# Altium project pay-ssm.PrjPCB (part 1 of 2)
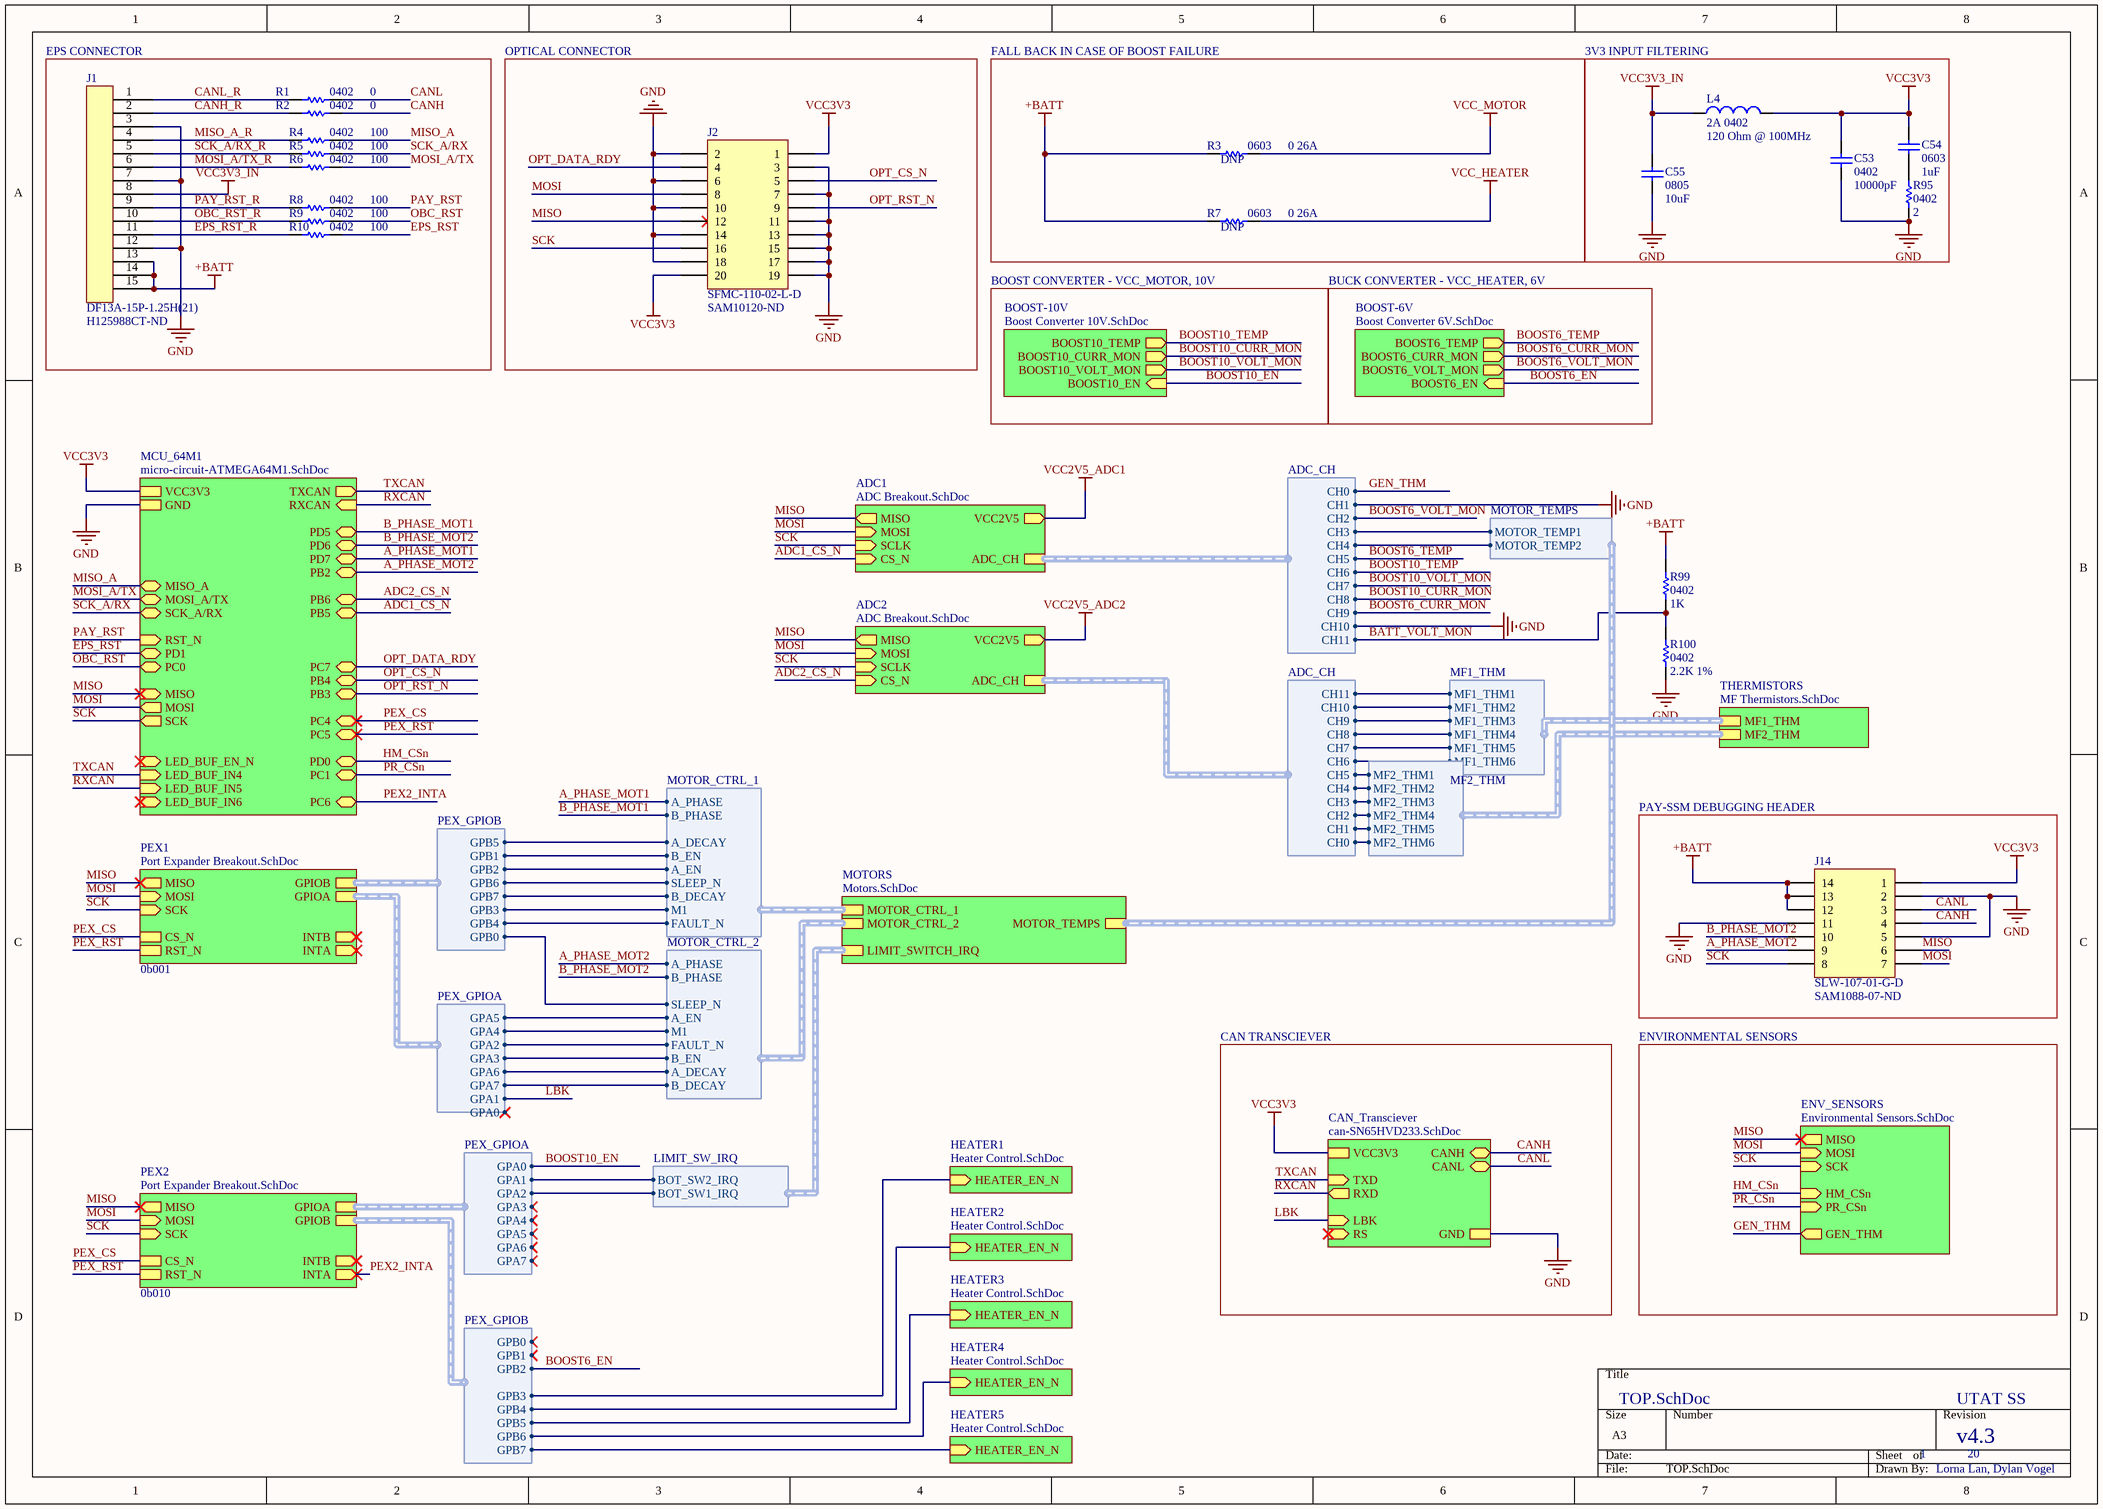
[diagram p0: TOP.SchDoc]
PROJ_ORG: UTAT SS; PROJ_REVISION: 4.2
11 sheets, 183 parts. Net scope: hierarchical (ports join the sheet entries above them; power ports are global).
Board files: pay-ssm-v3.PcbDoc, pay-ssm-v4-5.PcbDoc
Sheets:
  TOP.SchDoc
    ENV_SENSORS = Environmental Sensors.SchDoc
    BOOST-10V = Boost Converter 10V.SchDoc
    PEX1 = Port Expander Breakout.SchDoc
    PEX2 = Port Expander Breakout.SchDoc
    MOTORS = Motors.SchDoc
      MOTOR_FB = Motors State Monitor.SchDoc
      MOTOR_DRV1 = DRV8834.SchDoc
      MOTOR_DRV2 = DRV8834.SchDoc
    HEATER1 = Heater Control.SchDoc
    HEATER2 = Heater Control.SchDoc
    HEATER3 = Heater Control.SchDoc
    HEATER4 = Heater Control.SchDoc
    HEATER5 = Heater Control.SchDoc
    THERMISTORS = MF Thermistors.SchDoc
    ADC1 = ADC Breakout.SchDoc
    ADC2 = ADC Breakout.SchDoc
    BOOST-6V = Boost Converter 6V.SchDoc

## Sheet TOP.SchDoc
size A3; DrawnBy: Lorna Lan, Dylan Vogel; DocumentNumber: 1; Revision: v4.3; SheetNumber: 1; SheetTotal: 20

### Parts
C53  0402  value 10000pF  [CAP0402R]
C54  0603  value 1uF  [CAP0603R]
C55  0805  value 10uF  [CAP0805R]
J1  DF13A-15P-1.25H(21)  Supplier Part Number 1: H125988CT-ND  [DF13A-15P-1.25H(21)]
J2  SFMC-110-02-L-D  Supplier Part Number 1: SAM10120-ND  [TFM-110-02-L-D]
J14  SLW-107-01-G-D  Supplier Part Number 1: SAM1088-07-ND  [SLW-107-01-X-D]
L4  2A 0402  value 120 Ohm @ 100MHz  [RES0402R]
R1  0402  value 0  [RES0402R]
R2  0402  value 0  [RES0402R]
R3  0603  value 0 26A  [RES0603R]
R4  0402  value 100  [RES0402R]
R5  0402  value 100  [RES0402R]
R6  0402  value 100  [RES0402R]
R7  0603  value 0 26A  [RES0603R]
R8  0402  value 100  [RES0402R]
R9  0402  value 100  [RES0402R]
R10  0402  value 100  [RES0402R]
R95  0402  value 2  [RES0402R]
R99  0402  value 1K  [RES0402R]
R100  0402  value 2.2K 1%  [RES0402R]

### Blocks framed on the sheet
EPS CONNECTOR: J1 R1 R2 R4-R6 R8-R10
OPTICAL CONNECTOR: J2
3V3 INPUT FILTERING: C53-C55 L4 R95
PAY-SSM DEBUGGING HEADER: J14

### Sub-sheets
ADC1 = ADC Breakout.SchDoc: MISO (out), ADC_CH (harness ADC_CH), SCLK (in), MOSI (in), CS_N (in), VCC2V5 (out)
ADC2 = ADC Breakout.SchDoc: MISO (out), ADC_CH (harness ADC_CH), SCLK (in), MOSI (in), CS_N (in), VCC2V5 (out)
BOOST-6V = Boost Converter 6V.SchDoc: BOOST6_TEMP (out), BOOST6_CURR_MON (out), BOOST6_VOLT_MON (out), BOOST6_EN (in)
BOOST-10V = Boost Converter 10V.SchDoc: BOOST10_CURR_MON (out), BOOST10_VOLT_MON (out), BOOST10_EN (in), BOOST10_TEMP (out)
CAN_Transciever = can-SN65HVD233.SchDoc (file not in this document): RS (in), GND, CANH (bidir), CANL (bidir), LBK (in), TXD (in), RXD (out), VCC3V3
ENV_SENSORS = Environmental Sensors.SchDoc: SCK (in), MOSI (in), MISO (out), PR_CSn (in), HM_CSn (in), GEN_THM (out)
HEATER1 = Heater Control.SchDoc: HEATER_EN_N (in)
HEATER2 = Heater Control.SchDoc: HEATER_EN_N (in)
HEATER3 = Heater Control.SchDoc: HEATER_EN_N (in)
HEATER4 = Heater Control.SchDoc: HEATER_EN_N (in)
HEATER5 = Heater Control.SchDoc: HEATER_EN_N (in)
MCU_64M1 = micro-circuit-ATMEGA64M1.SchDoc (file not in this document): GND, PD6 (bidir), PD1 (bidir), PC7 (bidir), PC4 (bidir), PB5 (bidir), PB2 (bidir), PB3 (bidir), PB4 (bidir), PC0 (bidir), TXCAN (out), RXCAN (in), SCK (out), MOSI (out), LED_BUF_IN6 (in), MOSI_A/TX (bidir), LED_BUF_IN4 (in), LED_BUF_IN5 (in), SCK_A/RX (bidir), MISO (in), MISO_A (bidir), RST_N (in), LED_BUF_EN_N (in), VCC3V3, PD7 (bidir), PC6 (bidir), PD5 (bidir), PC5 (bidir), PB6 (bidir), PD0 (bidir), PC1 (bidir)
MOTORS = Motors.SchDoc: MOTOR_CTRL_1 (harness MOTOR_CTRL_1), MOTOR_CTRL_2 (harness MOTOR_CTRL_2), MOTOR_TEMPS (harness MOTOR_TEMPS), LIMIT_SWITCH_IRQ (harness LIMIT_SW_IRQ)
PEX1 = Port Expander Breakout.SchDoc: INTB (out), INTA (out), GPIOA (harness PEX_GPIOA), MISO (out), MOSI (in), GPIOB (harness PEX_GPIOB), SCK (in), RST_N, CS_N  | ADDRESS: 0b001
PEX2 = Port Expander Breakout.SchDoc: INTB (out), INTA (out), GPIOA (harness PEX_GPIOA), MISO (out), MOSI (in), GPIOB (harness PEX_GPIOB), SCK (in), RST_N, CS_N  | ADDRESS: 0b010
THERMISTORS = MF Thermistors.SchDoc: MF1_THM (harness MF1_THM), MF2_THM (harness MF2_THM)

### Harnesses
MOTOR_CTRL_1: SLEEP_N, A_EN, A_PHASE, B_PHASE, FAULT_N, M1, A_DECAY, B_DECAY, B_EN
PEX_GPIOA: GPA0, GPA1, GPA2, GPA3, GPA4, GPA5, GPA6, GPA7
PEX_GPIOB: GPB1, GPB6, GPB5, GPB4, GPB3, GPB0, GPB2, GPB7
MOTOR_CTRL_2: SLEEP_N, A_EN, B_EN, A_PHASE, B_PHASE, FAULT_N, M1, A_DECAY, B_DECAY
ADC_CH: CH0, CH1, CH2, CH3, CH4, CH5, CH6, CH7, CH8, CH9, CH10, CH11
PEX_GPIOB: GPB0, GPB1, GPB2, GPB3, GPB4, GPB5, GPB6, GPB7
MOTOR_TEMPS: MOTOR_TEMP1, MOTOR_TEMP2
MF1_THM: MF1_THM1, MF1_THM2, MF1_THM3, MF1_THM4, MF1_THM5, MF1_THM6
MF2_THM: MF2_THM1, MF2_THM2, MF2_THM3, MF2_THM4, MF2_THM5, MF2_THM6
LIMIT_SW_IRQ: BOT_SW1_IRQ, BOT_SW2_IRQ

### Nets
+BATT: J1.13 J1.14 J1.15 J14.2(14) J14.4(13) J14.6(12) R3.1 R7.1 R99.2
GND: C53.1 C55.1 J1.3 J1.7 J1.12 J2.2 J2.3 J2.6 J2.7 J2.10 J2.11 J2.13 J2.14 J2.15 J2.17 J2.18 J2.19 J14.3(2) J14.8(11) J14.9(5) R95.1 R100.1 ; sheet CAN_Transciever/GND, sheet MCU_64M1/GND, sheet ADC1/ADC_CH.CH1, sheet ADC1/ADC_CH.CH10
VCC2V5_ADC1: sheet ADC1/VCC2V5
VCC2V5_ADC2: sheet ADC2/VCC2V5
VCC3V3: C53.2 C54.2 J2.1 J2.20 J14.1 L4.2 ; sheet CAN_Transciever/VCC3V3, sheet MCU_64M1/VCC3V3
VCC3V3_IN: C55.2 J1.8 L4.1
VCC_HEATER: R7.2
VCC_MOTOR: R3.2
A_PHASE_MOT1: sheet MCU_64M1/PD7, sheet MOTORS/MOTOR_CTRL_1.A_PHASE
A_PHASE_MOT2: J14.12(9) ; sheet MCU_64M1/PB2, sheet MOTORS/MOTOR_CTRL_2.A_PHASE
ADC1_CS_N: sheet MCU_64M1/PB5, sheet ADC1/CS_N
ADC2_CS_N: sheet MCU_64M1/PB6, sheet ADC2/CS_N
ADECAY_MOTOR_DRV1: sheet MOTORS/MOTOR_CTRL_1.A_DECAY, sheet PEX1/GPIOB.GPB5
ADECAY_MOTOR_DRV2: sheet MOTORS/MOTOR_CTRL_2.A_DECAY, sheet PEX1/GPIOA.GPA6
AENBL_MOTOR_DRV1: sheet MOTORS/MOTOR_CTRL_1.A_EN, sheet PEX1/GPIOB.GPB2
AENBL_MOTOR_DRV2: sheet MOTORS/MOTOR_CTRL_2.A_EN, sheet PEX1/GPIOA.GPA5
B_PHASE_MOT1: sheet MCU_64M1/PD5, sheet MOTORS/MOTOR_CTRL_1.B_PHASE
B_PHASE_MOT2: J14.10 ; sheet MCU_64M1/PD6, sheet MOTORS/MOTOR_CTRL_2.B_PHASE
BATT_VOLT_MON: R99.1 R100.2 ; sheet ADC1/ADC_CH.CH11
BDECAY_MOTOR_DRV1: sheet MOTORS/MOTOR_CTRL_1.B_DECAY, sheet PEX1/GPIOB.GPB7
BDECAY_MOTOR_DRV2: sheet MOTORS/MOTOR_CTRL_2.B_DECAY, sheet PEX1/GPIOA.GPA7
BENBL_MOTOR_DRV1: sheet MOTORS/MOTOR_CTRL_1.B_EN, sheet PEX1/GPIOB.GPB1
BENBL_MOTOR_DRV2: sheet MOTORS/MOTOR_CTRL_2.B_EN, sheet PEX1/GPIOA.GPA3
BOOST6_CURR_MON: sheet BOOST-6V/BOOST6_CURR_MON, sheet ADC1/ADC_CH.CH9
BOOST6_EN: sheet BOOST-6V/BOOST6_EN, sheet PEX2/GPIOB.GPB2
BOOST6_TEMP: sheet BOOST-6V/BOOST6_TEMP, sheet ADC1/ADC_CH.CH5
BOOST6_VOLT_MON: sheet BOOST-6V/BOOST6_VOLT_MON, sheet ADC1/ADC_CH.CH2
BOOST10_CURR_MON: sheet BOOST-10V/BOOST10_CURR_MON, sheet ADC1/ADC_CH.CH8
BOOST10_EN: sheet BOOST-10V/BOOST10_EN, sheet PEX2/GPIOA.GPA0
BOOST10_TEMP: sheet BOOST-10V/BOOST10_TEMP, sheet ADC1/ADC_CH.CH6
BOOST10_VOLT_MON: sheet BOOST-10V/BOOST10_VOLT_MON, sheet ADC1/ADC_CH.CH7
BOT_SW1_IRQ: sheet PEX2/GPIOA.GPA2, sheet MOTORS/LIMIT_SWITCH_IRQ.BOT_SW1_IRQ
BOT_SW2_IRQ: sheet PEX2/GPIOA.GPA1, sheet MOTORS/LIMIT_SWITCH_IRQ.BOT_SW2_IRQ
CANH: J14.7(4) R2.2 ; sheet CAN_Transciever/CANH
CANH_R: J1.2 R2.1
CANL: J14.5(3) R1.2 ; sheet CAN_Transciever/CANL
CANL_R: J1.1 R1.1
EPS_RST: R10.2 ; sheet MCU_64M1/PD1
EPS_RST_R: J1.11 R10.1
GEN_THM: sheet ENV_SENSORS/GEN_THM, sheet ADC1/ADC_CH.CH0
HEATER_EN_N_HEATER1: sheet HEATER1/HEATER_EN_N, sheet PEX2/GPIOB.GPB3
HEATER_EN_N_HEATER2: sheet HEATER2/HEATER_EN_N, sheet PEX2/GPIOB.GPB4
HEATER_EN_N_HEATER3: sheet HEATER3/HEATER_EN_N, sheet PEX2/GPIOB.GPB5
HEATER_EN_N_HEATER4: sheet HEATER4/HEATER_EN_N, sheet PEX2/GPIOB.GPB6
HEATER_EN_N_HEATER5: sheet HEATER5/HEATER_EN_N, sheet PEX2/GPIOB.GPB7
HM_CSn: sheet ENV_SENSORS/HM_CSn, sheet MCU_64M1/PD0
LBK: sheet CAN_Transciever/LBK, sheet PEX1/GPIOA.GPA1
M1_MOTOR_DRV1: sheet MOTORS/MOTOR_CTRL_1.M1, sheet PEX1/GPIOB.GPB3
M1_MOTOR_DRV2: sheet MOTORS/MOTOR_CTRL_2.M1, sheet PEX1/GPIOA.GPA4
MF1_THM1: sheet ADC2/ADC_CH.CH11, sheet THERMISTORS/MF1_THM.MF1_THM1
MF1_THM2: sheet ADC2/ADC_CH.CH10, sheet THERMISTORS/MF1_THM.MF1_THM2
MF1_THM3: sheet ADC2/ADC_CH.CH9, sheet THERMISTORS/MF1_THM.MF1_THM3
MF1_THM4: sheet ADC2/ADC_CH.CH8, sheet THERMISTORS/MF1_THM.MF1_THM4
MF1_THM5: sheet ADC2/ADC_CH.CH7, sheet THERMISTORS/MF1_THM.MF1_THM5
MF1_THM6: sheet ADC2/ADC_CH.CH6, sheet THERMISTORS/MF1_THM.MF1_THM6
MF2_THM1: sheet ADC2/ADC_CH.CH5, sheet THERMISTORS/MF2_THM.MF2_THM1
MF2_THM2: sheet ADC2/ADC_CH.CH4, sheet THERMISTORS/MF2_THM.MF2_THM2
MF2_THM3: sheet ADC2/ADC_CH.CH3, sheet THERMISTORS/MF2_THM.MF2_THM3
MF2_THM4: sheet ADC2/ADC_CH.CH2, sheet THERMISTORS/MF2_THM.MF2_THM4
MF2_THM5: sheet ADC2/ADC_CH.CH1, sheet THERMISTORS/MF2_THM.MF2_THM5
MF2_THM6: sheet ADC2/ADC_CH.CH0, sheet THERMISTORS/MF2_THM.MF2_THM6
MISO: J2.12 J14.11(6) ; sheet ENV_SENSORS/MISO, sheet MCU_64M1/MISO, sheet PEX1/MISO, sheet PEX2/MISO, sheet ADC1/MISO, sheet ADC2/MISO
MISO_A: R4.2 ; sheet MCU_64M1/MISO_A
MISO_A_R: J1.4 R4.1
MOSI: J2.8 J14.13(7) ; sheet ENV_SENSORS/MOSI, sheet MCU_64M1/MOSI, sheet PEX1/MOSI, sheet PEX2/MOSI, sheet ADC1/MOSI, sheet ADC2/MOSI
MOSI_A/TX: R6.2 ; sheet MCU_64M1/MOSI_A/TX
MOSI_A/TX_R: J1.6 R6.1
nFAULT_MOTOR_DRV1: sheet MOTORS/MOTOR_CTRL_1.FAULT_N, sheet PEX1/GPIOB.GPB4
nFAULT_MOTOR_DRV2: sheet MOTORS/MOTOR_CTRL_2.FAULT_N, sheet PEX1/GPIOA.GPA2
nSLEEP_MOTOR_DRV1: sheet MOTORS/MOTOR_CTRL_1.SLEEP_N, sheet PEX1/GPIOB.GPB6
nSLEEP_MOTOR_DRV2: sheet MOTORS/MOTOR_CTRL_2.SLEEP_N, sheet PEX1/GPIOB.GPB0
OBC_RST: R9.2 ; sheet MCU_64M1/PC0
OBC_RST_R: J1.10 R9.1
OPT_CS_N: J2.5 ; sheet MCU_64M1/PB4
OPT_DATA_RDY: J2.4 ; sheet MCU_64M1/PC7
OPT_RST_N: J2.9 ; sheet MCU_64M1/PB3
PAY_RST: R8.2 ; sheet MCU_64M1/RST_N
PAY_RST_R: J1.9 R8.1
PEX2_INTA: sheet MCU_64M1/PC6, sheet PEX2/INTA
PEX_CS: sheet MCU_64M1/PC4, sheet PEX1/CS_N, sheet PEX2/CS_N
PEX_RST: sheet MCU_64M1/PC5, sheet PEX1/RST_N, sheet PEX2/RST_N
PR_CSn: sheet ENV_SENSORS/PR_CSn, sheet MCU_64M1/PC1
RXCAN: sheet CAN_Transciever/RXD, sheet MCU_64M1/RXCAN, sheet MCU_64M1/LED_BUF_IN5
SCK: J2.16 J14.14(8) ; sheet ENV_SENSORS/SCK, sheet MCU_64M1/SCK, sheet PEX1/SCK, sheet PEX2/SCK, sheet ADC1/SCLK, sheet ADC2/SCLK
SCK_A/RX: R5.2 ; sheet MCU_64M1/SCK_A/RX
SCK_A/RX_R: J1.5 R5.1
TXCAN: sheet CAN_Transciever/TXD, sheet MCU_64M1/TXCAN, sheet MCU_64M1/LED_BUF_IN4
NetC54_1: C54.1 R95.2
(unnamed): sheet ADC1/ADC_CH.CH3, sheet MOTORS/MOTOR_TEMPS.MOTOR_TEMP1
(unnamed): sheet ADC1/ADC_CH.CH4, sheet MOTORS/MOTOR_TEMPS.MOTOR_TEMP2

### Notes on the sheet
- FALL BACK IN CASE OF BOOST FAILURE
- (near R3) DNP
- (near R7) DNP
- BOOST CONVERTER - VCC_MOTOR, 10V
- BUCK CONVERTER - VCC_HEATER, 6V
- CAN TRANSCIEVER
- ENVIRONMENTAL SENSORS

### Library data of the parts
C53 = Cap: Capacitor; Published: 8-Jun-2000; LatestRevisionDate: 17-Jul-2002; LatestRevisionNote: Re-released for DXP Platform.; PackageReference: RAD-0.3; Publisher: Altium Limited; PackageDescription: Radial Cap, Thru-Hole; 2 Leads; 0.3 in Pin Spacing
C54 = CAP0603: 0603 capacitor; Manufacturer: KEMET; Manufacturer Part Number: C0603C105K4RACAUTO; Tolerance: 10%; Voltage Rating: 16V; Supplier 1: Digi-Key; Supplier Part Number 1: 399-17704-1-ND; Stock 1: 376276; Pricing 1: 1=0.17, 10=0.12, 100=0.0564, 500=0.03952, 1000=0.03273 (USD); Mount: Surface Mount; Case/Package: 0603; Case Code (Imperial): 0603; Case Code (Metric): 1608; Min Operating Temperature: -55°C; Max Operating Temperature: 125°C; Packaging: Cut Tape; Capacitance: 1uF; Ratings: AEC-Q200; Supplier 2: Digi-Key; Supplier Part Number 2: 587-3467-1-ND
C55 = CAP0805: 0805 capacitor; Manufacturer: Murata; Manufacturer Part Number: GCM21BR70J106KE22K; Tolerance: 10%; Dielectric: X7R; Voltage Rating (DC): 6.3V; Supplier 1: Digi-Key; Supplier Part Number 1: 490-14361-1-ND; Stock 1: 214938; Pricing 1: 1=0.42, 10=0.29, 100=0.1742, 500=0.13064, 1000=0.11031, 2500=0.10451, 5000=0.0987 (USD); Case/Package: 0805; Min Operating Temperature: -55°C; Max Operating Temperature: 125°C; Capacitance: 10uF; Packaging: Tape and Reel; Length: 2mm; Depth: 1.25mm; Lead Free: Lead Free
J1 = DF13A-15P-1.25H(21): 15 pos DF13 right angle surface mount connector; Supplier 1: Digi-Key
J2 = SFMC-110-02-L-D: 20 pos 50mil pitch low profile SMD connector; Supplier 1: Digi-Key
J14 = SLW-107-01-G-D: 14 pos 100 mil pitch low profile header; Supplier 1: Digi-Key
L4 = Inductor: Manufacturer: Murata; Manufacturer Part Number: BLM15PX121SZ1D; Code_IEC: 1005; Number of Lines: 1; DC Resistance (DCR): 55mR; Published: 8-Jun-2000; LatestRevisionDate: 29-May-2009; LatestRevisionNote: IPC-7351 Footprint Added.; PackageReference: 0402-A; Publisher: Altium Limited; PackageDescription: Chip Inductor; Code_JEITA: 0402; Supplier 1: Digi-Key; Supplier Part Number 1: 490-16505-1-ND; Stock 1: 18936; Pricing 1: 1=0.15, 10=0.125, 25=0.0972, 50=0.0804, 100=0.0693, 250=0.05544, 500=0.0499, 1000=0.04158, 5000=0.03881 (USD); Mount: Surface Mount; Case/Package: 0402; Case Code (Imperial): 0402; Case Code (Metric): 1005; Min Operating Temperature: -55°C; Max Operating Temperature: 125°C; Packaging: Cut Tape; Max Current Rating: 2A; Ratings: AEC-Q200
R1 R2 = RES0402: 0402 resistor; Manufacturer: Panasonic; Manufacturer Part Number: ERJ-2GE0R00X; Resistance: 0mR; Power Rating: 100mW; Voltage Rating: 50V; Tolerance: 5%; Temperature Coefficient: 600ppm/°C; Supplier 1: Digi-Key; Supplier Part Number 1: P0.0JCT-ND; Stock 1: 47740000; Pricing 1: 1=0.1, 10=0.03, 25=0.0216, 50=0.0164, 100=0.0121, 250=0.00924, 500=0.0074, 1000=0.00545, 5000=0.00391 (USD); Mount: Surface Mount; Case/Package: 0402; Case Code (Metric): 1005; Case Code (Imperial): 0402; Contact Plating: Tin; Min Operating Temperature: -55°C; Max Operating Temperature: 155°C; Packaging: Tape and Reel; Package Quantity: 1; Composition: Thick Film; Number of Terminations: 2; Termination: SMD/SMT; Military Standard: Not; Max Power Dissipation: 100mW; Voltage Rating (DC): 50V; Features: Automotive AEC-Q200; Length: 1mm; Height: 0.35mm; Width: 0.02inch; Depth: 0.5mm; Radiation Hardening: No; REACH SVHC: No SVHC; Lead Free: Lead Free; ComponentLink1URL: http://industrial.panasonic.com/www-data/pdf/AOA0000/AOA0000CE1.pdf?src-supplier=Avnet; ComponentLink1Description: http://industrial.panasonic.com/www-data/pdf/AOA0000/AOA0000CE1.pdf?src-supplier=Avnet; ComponentLink2URL: http://www.alliedelec.com/m/d/51cd0790071e1666bdb9d00c57fcf960.pdf?src-supplier=Allied+Electronics; ComponentLink2Description: http://www.alliedelec.com/m/d/51cd0790071e1666bdb9d00c57fcf960.pdf?src-supplier=Allied+Electronics; ComponentLink3URL: http://industrial.panasonic.com/www-data/pdf/AOA0000/AOA0000CE1.pdf?src-supplier=Avnet+Europe; ComponentLink3Description: http://industrial.panasonic.com/www-data/pdf/AOA0000/AOA0000CE1.pdf?src-supplier=Avnet+Europe; ComponentLink4URL: http://www.farnell.com/datasheets/2059623.pdf?src-supplier=Farnell; ComponentLink4Description: http://www.farnell.com/datasheets/2059623.pdf?src-supplier=Farnell; ComponentLink5URL: http://www.farnell.com/datasheets/2059623.pdf?src-supplier=Element14; ComponentLink5Description: http://www.farnell.com/datasheets/2059623.pdf?src-supplier=Element14; ComponentLink6URL: http://www.farnell.com/datasheets/1678796.pdf?src-supplier=Element14; ComponentLink6Description: http://www.farnell.com/datasheets/1678796.pdf?src-supplier=Element14
R3 R7 = RES0603: 0603 resistor; Supplier 1: Digi-Key; Supplier Part Number 1: 2019-TLRZ1JTTDCT-ND
R4-R6 R8-R10 R99 R100 = RES0402: 0402 resistor
  R99: Supplier 1: Digi-Key; Supplier Part Number 1: YAG1234CT-ND
R95 = Res1: Resistor; Published: 8-Jun-2000; LatestRevisionDate: 17-Jul-2002; LatestRevisionNote: Re-released for DXP Platform.; PackageReference: AXIAL-0.3; Publisher: Altium Limited; PackageDescription: Axial Device, Thru-Hole; 2 Leads; 0.3 in Pin Spacing; Supplier 1: Digi-Key; Supplier Part Number 1: YAG3472CT-ND

## Sheet Environmental Sensors.SchDoc
size A4; DrawnBy: Dylan Vogel, Lorna Lan; DocumentNumber: 19; Revision: v4.2; SheetNumber: 19; SheetTotal: 20
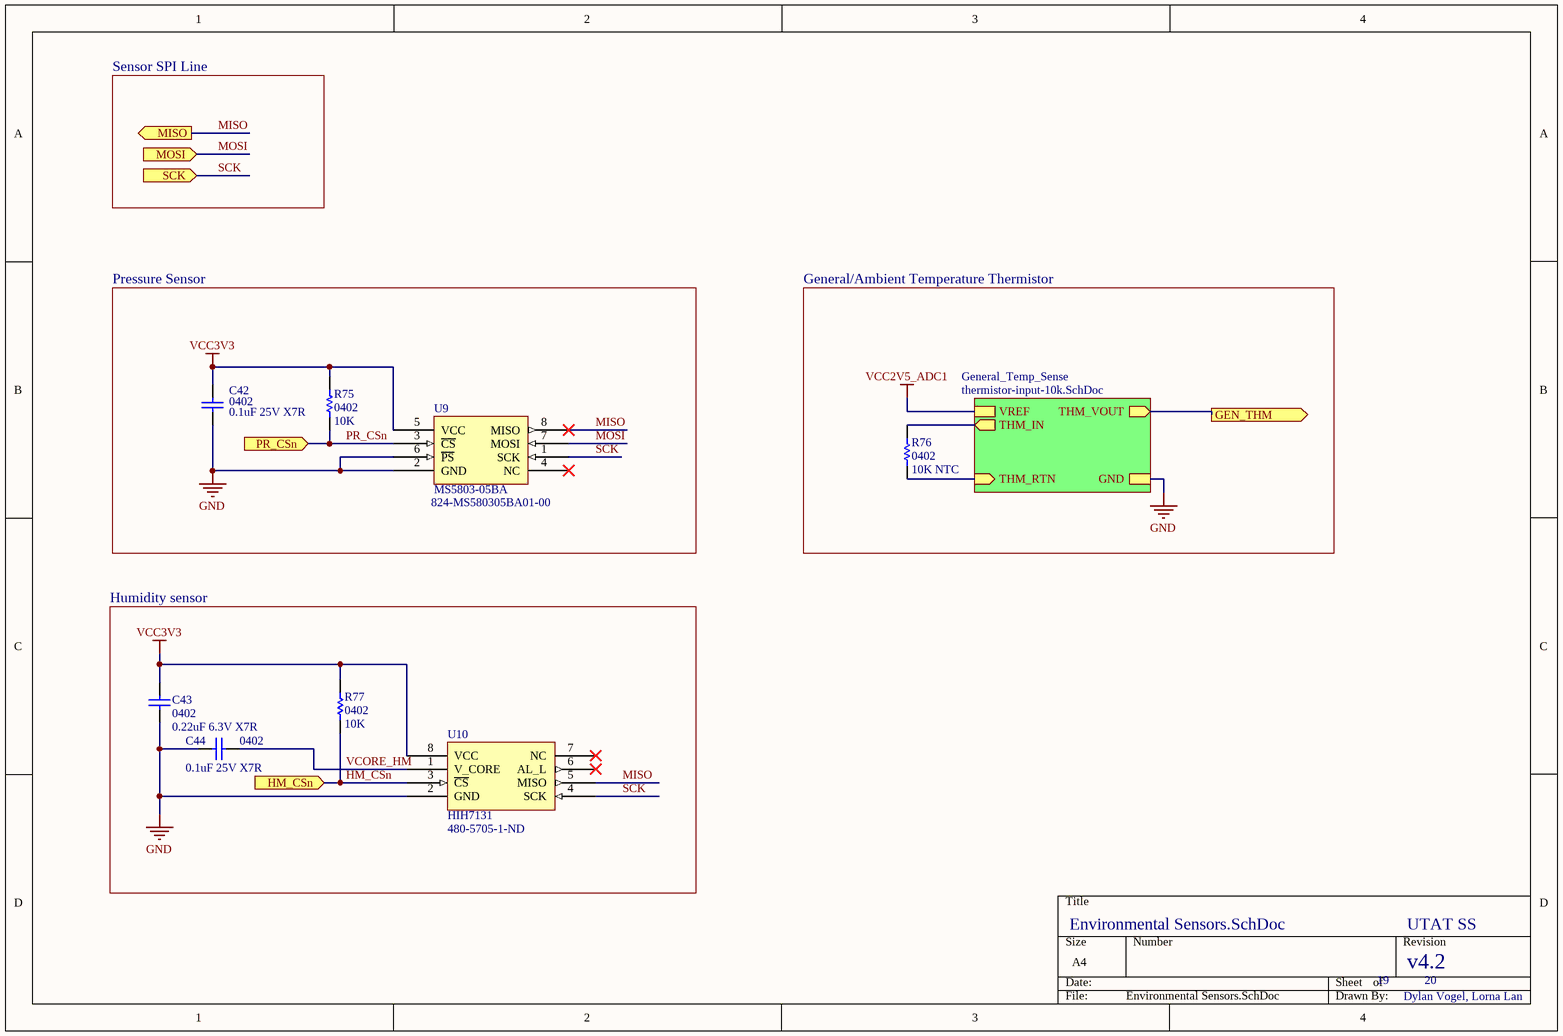
[diagram p1: Environmental Sensors.SchDoc]

### Parts
C42  0402  value 0.1uF 25V X7R  [CAP0402R]
C43  0402  value 0.22uF 6.3V X7R  [CAP0402R]
C44  0402  value 0.1uF 25V X7R  [CAP0402R]
R75  0402  value 10K  [RES0402R]
R76  0402  value 10K NTC  [RES0402R]
R77  0402  value 10K  [RES0402R]
U9  MS5803-05BA  Supplier Part Number 1: 824-MS580305BA01-00  [MS5803_125P640x620-8N]
U10  HIH7131  Supplier Part Number 1: 480-5705-1-ND  [SOIC127P500X600-8N]

### Blocks framed on the sheet
Pressure Sensor: C42 R75 U9
General/Ambient Temperature Thermistor: R76
Humidity sensor: C43 C44 R77 U10

### Sub-sheets
General_Temp_Sense = thermistor-input-10k.SchDoc (file not in this document): GND, VREF, THM_RTN (in), THM_IN (out), THM_VOUT (out)

### Ports
GEN_THM (out), HM_CSn (in), MISO (out), MOSI (in), PR_CSn (in), SCK (in)

### Nets
GND: C42.1 C43.1 C44.1 U9.2(GND) U9.6(~{PS}) U10.2(GND) ; sheet General_Temp_Sense/GND
VCC2V5_ADC1: sheet General_Temp_Sense/VREF
VCC3V3: C42.2 C43.2 R75.2 R77.2 U9.5(VCC) U10.8(VCC)
GEN_THM: port GEN_THM, sheet General_Temp_Sense/THM_VOUT
HM_CSn: R77.1 U10.3(~{CS}) ; port HM_CSn
MISO: U9.8(MISO) U10.5(MISO) ; port MISO
MOSI: U9.7(MOSI) ; port MOSI
PR_CSn: R75.1 U9.3(~{CS}) ; port PR_CSn
SCK: U9.1(SCK) U10.4(SCK) ; port SCK
VCORE_HM: C44.2 U10.1(V_CORE)
NetR76_1: R76.1 ; sheet General_Temp_Sense/THM_RTN
NetR76_2: R76.2 ; sheet General_Temp_Sense/THM_IN

Not connected (* = marked no-connect by the designer): U9 4(NC)*; U10 6(AL_L)* 7(NC)*

### Notes on the sheet
- Sensor SPI Line

### Library data of the parts
C42-C44 = CAP0402: 0402 capacitor
R75 R77 = RES0402: 0402 resistor; Manufacturer: Panasonic; Manufacturer Part Number: ERJ-2RKF1002X; Resistance: 10kR; Power Rating: 100mW; Tolerance: 1%; Voltage Rating: 50V; Temperature Coefficient: 100ppm/°C; Supplier 1: Digi-Key; Supplier Part Number 1: P10.0KLCT-ND; Stock 1: 14350001; Pricing 1: 1=0.1, 10=0.045, 100=0.0183, 1000=0.00823, 2500=0.00715, 5000=0.0059 (USD); Mount: Surface Mount; Case/Package: 0402; Number of Pins: 2; Case Code (Metric): 1005; Case Code (Imperial): 0402; Contact Plating: Tin; Min Operating Temperature: -55°C; Max Operating Temperature: 155°C; Packaging: Tape and Reel; Package Quantity: 1; Composition: Thick Film; Number of Terminations: 2; Termination: SMD/SMT; Military Standard: Not; Max Power Dissipation: 100mW; Voltage Rating (DC): 50V; Features: Automotive AEC-Q200; Length: 1mm; Height: 0.35mm; Width: 0.02inch; Depth: 0.5mm; Radiation Hardening: No; REACH SVHC: No SVHC; Lead Free: Lead Free; ComponentLink1URL: http://industrial.panasonic.com/www-data/pdf/AOA0000/AOA0000CE2.pdf?src-supplier=Future+Electronics; ComponentLink1Description: http://industrial.panasonic.com/www-data/pdf/AOA0000/AOA0000CE2.pdf?src-supplier=Future+Electronics; ComponentLink2URL: http://industrial.panasonic.com/www-data/pdf/AOA0000/AOA0000CE2.pdf?src-supplier=Avnet+Europe; ComponentLink2Description: http://industrial.panasonic.com/www-data/pdf/AOA0000/AOA0000CE2.pdf?src-supplier=Avnet+Europe; ComponentLink3URL: https://industrial.panasonic.com/cdbs/www-data/pdf/RDA0000/DMA0000COL11.pdf?src-supplier=Mouser; ComponentLink3Description: https://industrial.panasonic.com/cdbs/www-data/pdf/RDA0000/DMA0000COL11.pdf?src-supplier=Mouser; ComponentLink4URL: http://www.farnell.com/datasheets/1678782.pdf?src-supplier=Element14; ComponentLink4Description: http://www.farnell.com/datasheets/1678782.pdf?src-supplier=Element14; ComponentLink5URL: http://www.farnell.com/datasheets/1911175.pdf?src-supplier=Farnell; ComponentLink5Description: http://www.farnell.com/datasheets/1911175.pdf?src-supplier=Farnell; ComponentLink6URL: http://www.jameco.com/Jameco/Products/ProdDS/1987020.pdf?src-supplier=Jameco; ComponentLink6Description: http://www.jameco.com/Jameco/Products/ProdDS/1987020.pdf?src-supplier=Jameco; ComponentLink7URL: http://industrial.panasonic.com/www-data/pdf/AOA0000/AOA0000CE2.pdf?src-supplier=Avnet; ComponentLink7Description: http://industrial.panasonic.com/www-data/pdf/AOA0000/AOA0000CE2.pdf?src-supplier=Avnet; ComponentLink8URL: http://www.alliedelec.com/m/d/623f45ff1957d936ff56d46fd1c28cac.pdf?src-supplier=Allied+Electronics; ComponentLink8Description: http://www.alliedelec.com/m/d/623f45ff1957d936ff56d46fd1c28cac.pdf?src-supplier=Allied+Electronics
R76 = RES0402: 0402 resistor
U9 = MS5803-05BA: Digital 24-bit pressure sensor with SPI output. Operating range from 0-5bar, includes onboard temperature sensor and hermetic seal.; ComponentLink1Description: 14BA-Datasheet; ComponentLink1URL: https://www.te.com/commerce/DocumentDelivery/DDEController?Action=srchrtrv&DocNm=MS5803-14BA&DocType=Data+Sheet&DocLang=English; ComponentLink2Description: 05BA-Datasheet; ComponentLink2URL: https://www.te.com/commerce/DocumentDelivery/DDEController?Action=srchrtrv&DocNm=MS5803-05BA&DocType=Data+Sheet&DocLang=English; Supplier 1: Mouser
U10 = HIH7131: Digital humidity/temperature sensors. +/- 3% RH, 0-100%, SPI output. Model version with filter and condensation resistant.; Supplier 1: Digi-Key; Supplier: Digi-Key; Supplier Part Number: 480-5705-1-ND; ComponentLink1Description: Datasheet; ComponentLink1URL: https://sensing.honeywell.com/index.php?ci_id=147071

## Sheet Boost Converter 10V.SchDoc
size A4; DrawnBy: Lorna Lan, Jaden Reimer; DocumentNumber: 10; Revision: v4.4; SheetNumber: 10; SheetTotal: 20
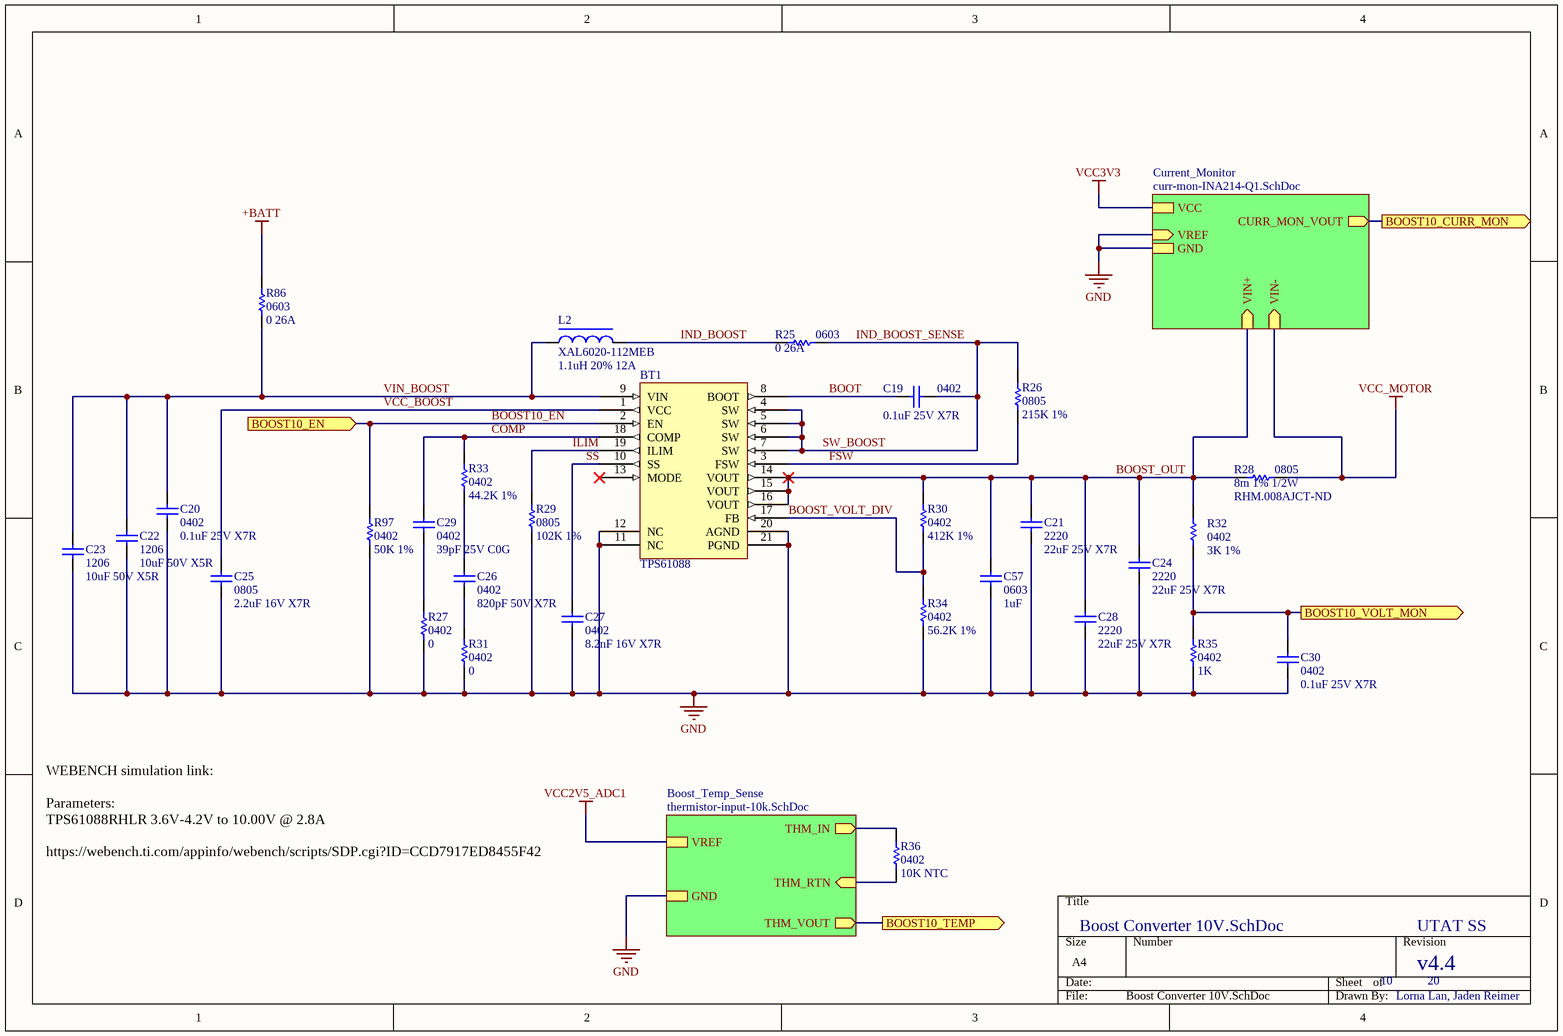
[diagram p2: Boost Converter 10V.SchDoc]

### Parts
BT1  TPS61088  [QFN50P450X350X100-21N]
C19  0402  value 0.1uF 25V X7R  [CAP0402R]
C20  0402  value 0.1uF 25V X7R  [CAP0402R]
C21  2220  value 22uF 25V X7R  [CAP2220]
C22  1206  value 10uF 50V X5R  [CAP1206R]
C23  1206  value 10uF 50V X5R  [CAP1206R]
C24  2220  value 22uF 25V X7R  [CAP2220]
C25  0805  value 2.2uF 16V X7R  [CAP0805R]
C26  0402  value 820pF 50V X7R  [CAP0402R]
C27  0402  value 8.2nF 16V X7R  [CAP0402R]
C28  2220  value 22uF 25V X7R  [CAP2220]
C29  0402  value 39pF 25V C0G  [CAP0402R]
C30  0402  value 0.1uF 25V X7R  [CAP0402R]
C57  0603  value 1uF  [CAP0603R]
L2  XAL6020-112MEB  value 1.1uH 20% 12A  [XAL6020-112MEB]
R25  0603  value 0 26A  [RES0603R]
R26  0805  value 215K 1%  [RES0805R]
R27  0402  value 0  [RES0402R]
R28  0805  value 8m 1% 1/2W  Supplier Part Number 1: RHM.008AJCT-ND  [RES0805R]
R29  0805  value 102K 1%  [RES0805R]
R30  0402  value 412K 1%  [RES0402R]
R31  0402  value 0  [RES0402R]
R32  0402  value 3K 1%  [RES0402R]
R33  0402  value 44.2K 1%  [RES0402R]
R34  0402  value 56.2K 1%  [RES0402R]
R35  0402  value 1K  [RES0402R]
R36  0402  value 10K NTC  [RES0402R]
R86  0603  value 0 26A  [RES0603R]
R97  0402  value 50K 1%  [RES0402R]

### Sub-sheets
Boost_Temp_Sense = thermistor-input-10k.SchDoc (file not in this document): GND, THM_VOUT (out), VREF, THM_IN (out), THM_RTN (in)
Current_Monitor = curr-mon-INA214-Q1.SchDoc (file not in this document): VCC, VREF (in), VIN+ (in), GND, VIN- (in), CURR_MON_VOUT (out)

### Ports
BOOST10_CURR_MON (out), BOOST10_EN (in), BOOST10_TEMP (out), BOOST10_VOLT_MON (out)

### Nets
+BATT: R86.2
GND: BT1.11(NC) BT1.12(NC) BT1.20(AGND) BT1.21(PGND) C20.1 C21.1 C22.1 C23.1 C24.1 C25.1 C27.1 C28.1 C30.1 C57.1 R27.1 R29.1 R31.1 R34.1 R35.1 R97.1 ; sheet Current_Monitor/VREF, sheet Current_Monitor/GND, sheet Boost_Temp_Sense/GND
VCC2V5_ADC1: sheet Boost_Temp_Sense/VREF
VCC_MOTOR: R28.2 ; sheet Current_Monitor/VIN-
BOOST10_CURR_MON: port BOOST10_CURR_MON, sheet Current_Monitor/CURR_MON_VOUT
BOOST10_EN: BT1.2(EN) R97.2 ; port BOOST10_EN
BOOST10_TEMP: port BOOST10_TEMP, sheet Boost_Temp_Sense/THM_VOUT
BOOST10_VOLT_MON: C30.2 R32.1 R35.2 ; port BOOST10_VOLT_MON
BOOST_OUT: BT1.14(VOUT) BT1.15(VOUT) BT1.16(VOUT) C21.2 C24.2 C28.2 C57.2 R28.1 R30.2 R32.2 ; sheet Current_Monitor/VIN+
BOOST_VOLT_DIV: BT1.17(FB) R30.1 R34.2
BOOT: BT1.8(BOOT) C19.2
COMP: BT1.18(COMP) C29.2 R33.2
FSW: BT1.3(FSW) R26.1
ILIM: BT1.19(ILIM) R29.2
IND_BOOST: L2.2 R25.1
IND_BOOST_SENSE: BT1.4(SW) BT1.5(SW) BT1.6(SW) BT1.7(SW) C19.1 R25.2 R26.2  [also labelled SW_BOOST]
SS: BT1.10(SS) C27.2
VCC_BOOST: BT1.1(VCC) C25.2
VIN_BOOST: BT1.9(VIN) C20.2 C22.2 C23.2 L2.1 R86.1
NetC26_1: C26.1 R31.2
NetC26_2: C26.2 R33.1
NetC29_1: C29.1 R27.2
NetR36_1: R36.1 ; sheet Boost_Temp_Sense/THM_RTN
NetR36_2: R36.2 ; sheet Boost_Temp_Sense/THM_IN

Not connected (* = marked no-connect by the designer): BT1 13(MODE)*

### Notes on the sheet
- WEBENCH simulation link:
  Parameters:
  TPS61088RHLR 3.6V-4.2V to 10.00V @ 2.8A
  https://webench.ti.com/appinfo/webench/scripts/SDP.cgi?ID=CCD7917ED8455F42

### Library data of the parts
BT1 = TPS61088: Boost converter; Supplier 1: Digi-Key; Supplier Part Number 1: 296-42129-1-ND
C19 C20 C26 C27 C29 C30 = CAP0402: 0402 capacitor
  C26: Supplier 1: Digi-Key; Supplier Part Number 1: 490-3250-1-ND
  C27: Supplier 1: Digi-Key; Supplier Part Number 1: 490-6338-1-ND
  C29: Supplier 1: Digi-Key; Supplier Part Number 1: 490-6178-1-ND
C21 C24 C28 = CAP2220: Ceramic Capacitor 2220 (5750 Metric); Supplier 1: Digi-Key; Supplier Part Number 1: 445-7934-1-ND
C22 C23 = CAP1206: 1206 capacitor; Supplier 1: Digi-Key; Supplier Part Number 1: 445-5998-1-ND
C25 = CAP0805: 0805 capacitor; Supplier 1: Digi-Key; Supplier Part Number 1: 490-3906-1-ND
C57 = CAP0603: as C54 on sheet TOP; Supplier 1: Digi-Key; Supplier Part Number 1: 399-17704-1-ND; Stock 1: 376276; Pricing 1: 1=0.17, 10=0.12, 100=0.0564, 500=0.03952, 1000=0.03273 (USD); Mount: Surface Mount; Case/Package: 0603; Case Code (Imperial): 0603; Case Code (Metric): 1608; Min Operating Temperature: -55°C; Max Operating Temperature: 125°C; Packaging: Cut Tape; Capacitance: 1uF; Ratings: AEC-Q200; Supplier 2: Digi-Key; Supplier Part Number 2: 587-3467-1-ND
L2 = XAL6020-112MEB: Fixed Inductors 1.1uH 20% 12A, 13.1mOhms AEC-Q200; ComponentLink1Description: Datasheet; ComponentLink1URL: https://www.mouser.ca/datasheet/2/597/xal6020-774588.pdf; Supplier 1: Mouser; Supplier Part Number 1: 994-XAL6020-112MEB
R25 R86 = RES0603: 0603 resistor; Supplier 1: Digi-Key; Supplier Part Number 1: 2019-TLRZ1JTTDCT-ND
R26 R28 R29 = RES0805: 0805 resistor; Supplier 1: Digi-Key
  R26: Supplier Part Number 1: P215KCCT-ND
  R29: Supplier Part Number 1: 541-102KCCT-ND
R27 R31 = RES0402: as R1 on sheet TOP; Supplier 1: Digi-Key; Supplier Part Number 1: P0.0JCT-ND; Stock 1: 47740000; Pricing 1: 1=0.1, 10=0.03, 25=0.0216, 50=0.0164, 100=0.0121, 250=0.00924, 500=0.0074, 1000=0.00545, 5000=0.00391 (USD); Mount: Surface Mount; Case/Package: 0402; Case Code (Metric): 1005; Case Code (Imperial): 0402; Contact Plating: Tin; Min Operating Temperature: -55°C; Max Operating Temperature: 155°C; Packaging: Tape and Reel; Package Quantity: 1; Composition: Thick Film; Number of Terminations: 2; Termination: SMD/SMT; Military Standard: Not; Max Power Dissipation: 100mW; Voltage Rating (DC): 50V; Features: Automotive AEC-Q200; Length: 1mm; Height: 0.35mm; Width: 0.02inch; Depth: 0.5mm; Radiation Hardening: No; REACH SVHC: No SVHC; Lead Free: Lead Free; ComponentLink1URL: http://industrial.panasonic.com/www-data/pdf/AOA0000/AOA0000CE1.pdf?src-supplier=Avnet; ComponentLink1Description: http://industrial.panasonic.com/www-data/pdf/AOA0000/AOA0000CE1.pdf?src-supplier=Avnet; ComponentLink2URL: http://www.alliedelec.com/m/d/51cd0790071e1666bdb9d00c57fcf960.pdf?src-supplier=Allied+Electronics; ComponentLink2Description: http://www.alliedelec.com/m/d/51cd0790071e1666bdb9d00c57fcf960.pdf?src-supplier=Allied+Electronics; ComponentLink3URL: http://industrial.panasonic.com/www-data/pdf/AOA0000/AOA0000CE1.pdf?src-supplier=Avnet+Europe; ComponentLink3Description: http://industrial.panasonic.com/www-data/pdf/AOA0000/AOA0000CE1.pdf?src-supplier=Avnet+Europe; ComponentLink4URL: http://www.farnell.com/datasheets/2059623.pdf?src-supplier=Farnell; ComponentLink4Description: http://www.farnell.com/datasheets/2059623.pdf?src-supplier=Farnell; ComponentLink5URL: http://www.farnell.com/datasheets/2059623.pdf?src-supplier=Element14; ComponentLink5Description: http://www.farnell.com/datasheets/2059623.pdf?src-supplier=Element14; ComponentLink6URL: http://www.farnell.com/datasheets/1678796.pdf?src-supplier=Element14; ComponentLink6Description: http://www.farnell.com/datasheets/1678796.pdf?src-supplier=Element14
R30 R32-R36 R97 = RES0402: 0402 resistor
  R30 R34: Supplier 1: Digi-Key; Supplier Part Number 1: 541-453KLCT-ND
  R32: Supplier 1: Digi-Key; Supplier Part Number 1: RMCF0402FT3K00CT-ND
  R35: Supplier 1: Digi-Key; Supplier Part Number 1: YAG1234CT-ND

## Sheet Port Expander Breakout.SchDoc
size A4; DrawnBy: Dylan Vogel; DocumentNumber: 5; Revision: v4.2; SheetNumber: 5; SheetTotal: 20
Used 2 times, as channels PEX1, PEX2. Parts and nets are listed once, with the designators drawn on the sheet.
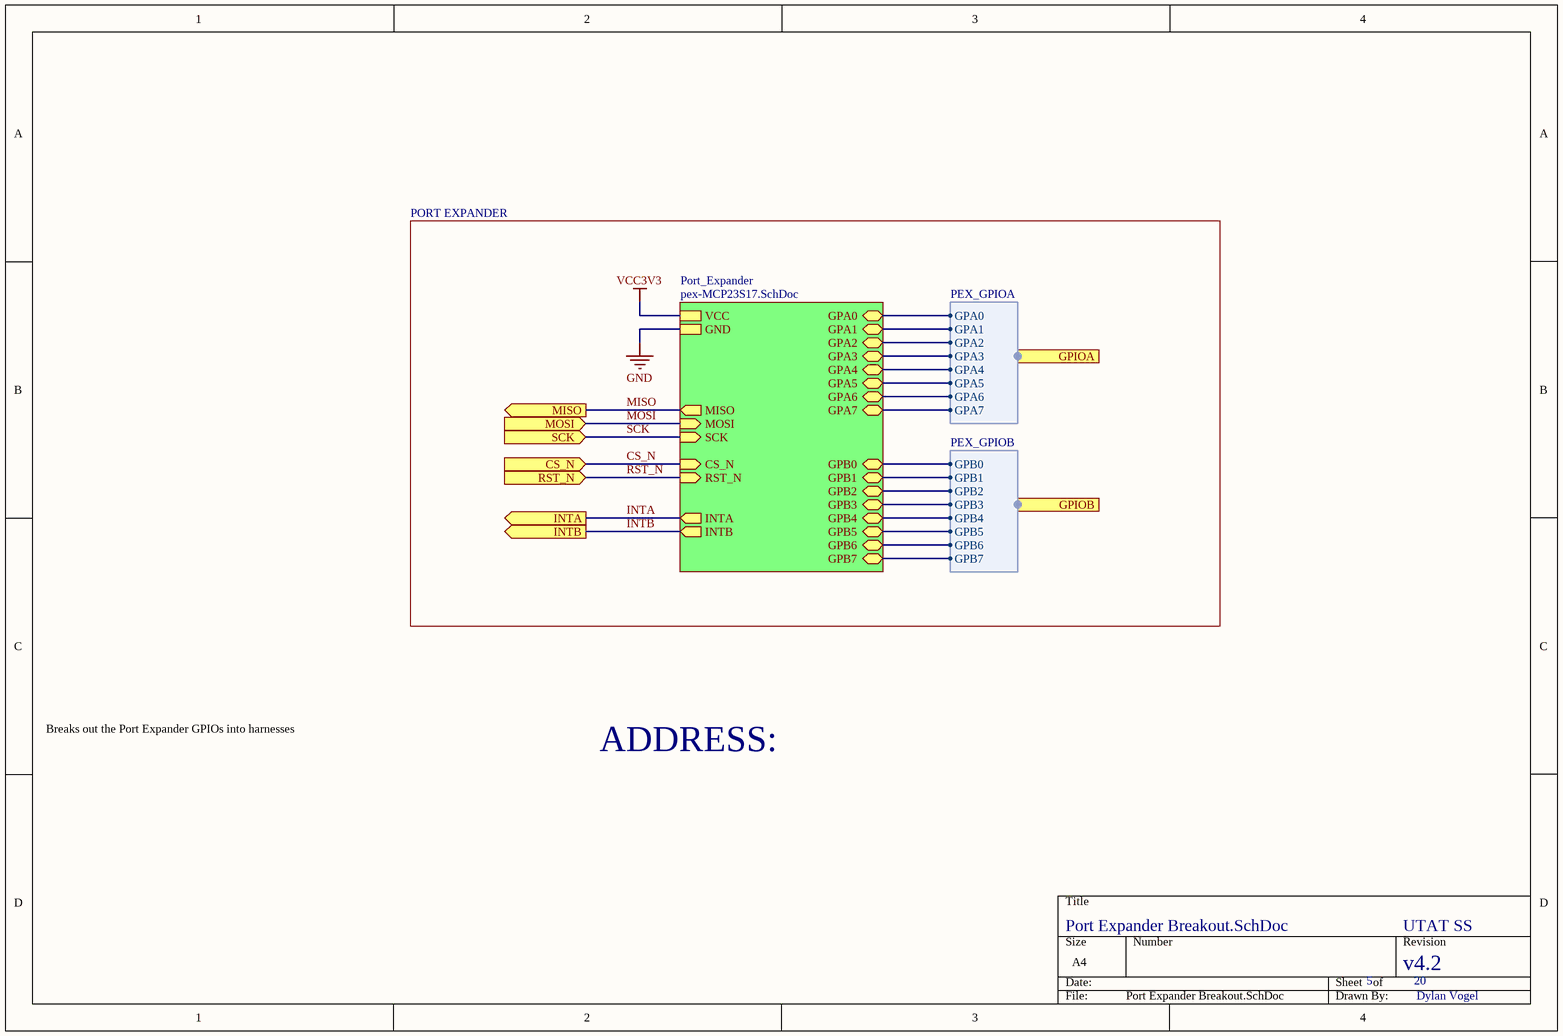
[diagram p3: Port Expander Breakout.SchDoc]

### Sub-sheets
Port_Expander = pex-MCP23S17.SchDoc (file not in this document): GPA0 (bidir), GPA6 (bidir), GPB1 (bidir), INTB (out), INTA (out), VCC, GND, MISO (out), MOSI (in), SCK (in), GPA4 (bidir), GPA2 (bidir), GPA7 (bidir), GPB6 (bidir), GPA5 (bidir), GPB7 (bidir), GPA3 (bidir), GPA1 (bidir), GPB4 (bidir), GPB2 (bidir), GPB3 (bidir), GPB5 (bidir), GPB0 (bidir), RST_N (in), CS_N (in)

### Ports
CS_N (in), GPIOA (harness PEX_GPIOA), GPIOB (harness PEX_GPIOB), INTA (out), INTB (out), MISO (out), MOSI (in), RST_N (in), SCK (in)

### Harnesses
PEX_GPIOA: GPA0, GPA1, GPA2, GPA3, GPA4, GPA5, GPA6, GPA7
PEX_GPIOB: GPB0, GPB1, GPB2, GPB3, GPB4, GPB5, GPB6, GPB7

### Nets
GND: sheet Port_Expander/GND
VCC3V3: sheet Port_Expander/VCC
CS_N: port CS_N, sheet Port_Expander/CS_N
INTA: port INTA, sheet Port_Expander/INTA
INTB: port INTB, sheet Port_Expander/INTB
MISO: port MISO, sheet Port_Expander/MISO
MOSI: port MOSI, sheet Port_Expander/MOSI
RST_N: port RST_N, sheet Port_Expander/RST_N
SCK: port SCK, sheet Port_Expander/SCK
(unnamed): sheet Port_Expander/GPA0, port GPIOA.GPA0
(unnamed): sheet Port_Expander/GPA6, port GPIOA.GPA6
(unnamed): sheet Port_Expander/GPB1, port GPIOB.GPB1
(unnamed): sheet Port_Expander/GPA4, port GPIOA.GPA4
(unnamed): sheet Port_Expander/GPA2, port GPIOA.GPA2
(unnamed): sheet Port_Expander/GPA7, port GPIOA.GPA7
(unnamed): sheet Port_Expander/GPB6, port GPIOB.GPB6
(unnamed): sheet Port_Expander/GPA5, port GPIOA.GPA5
(unnamed): sheet Port_Expander/GPB7, port GPIOB.GPB7
(unnamed): sheet Port_Expander/GPA3, port GPIOA.GPA3
(unnamed): sheet Port_Expander/GPA1, port GPIOA.GPA1
(unnamed): sheet Port_Expander/GPB4, port GPIOB.GPB4
(unnamed): sheet Port_Expander/GPB2, port GPIOB.GPB2
(unnamed): sheet Port_Expander/GPB3, port GPIOB.GPB3
(unnamed): sheet Port_Expander/GPB5, port GPIOB.GPB5
(unnamed): sheet Port_Expander/GPB0, port GPIOB.GPB0

### Channels
PEX1: ports CS_N=PEX_CS INTA=INTA_PEX1 INTB=INTB_PEX1 MISO=MISO MOSI=MOSI RST_N=PEX_RST SCK=SCK
PEX2: ports CS_N=PEX_CS INTA=PEX2_INTA INTB=INTB_PEX2 MISO=MISO MOSI=MOSI RST_N=PEX_RST SCK=SCK

### Notes on the sheet
- PORT EXPANDER
- ADDRESS:
- Breaks out the Port Expander GPIOs into harnesses

## Sheet Motors.SchDoc
size A4; DrawnBy: Lorna Lan, Dylan Vogel; DocumentNumber: 11; Revision: v4.2; SheetNumber: 11; SheetTotal: 20
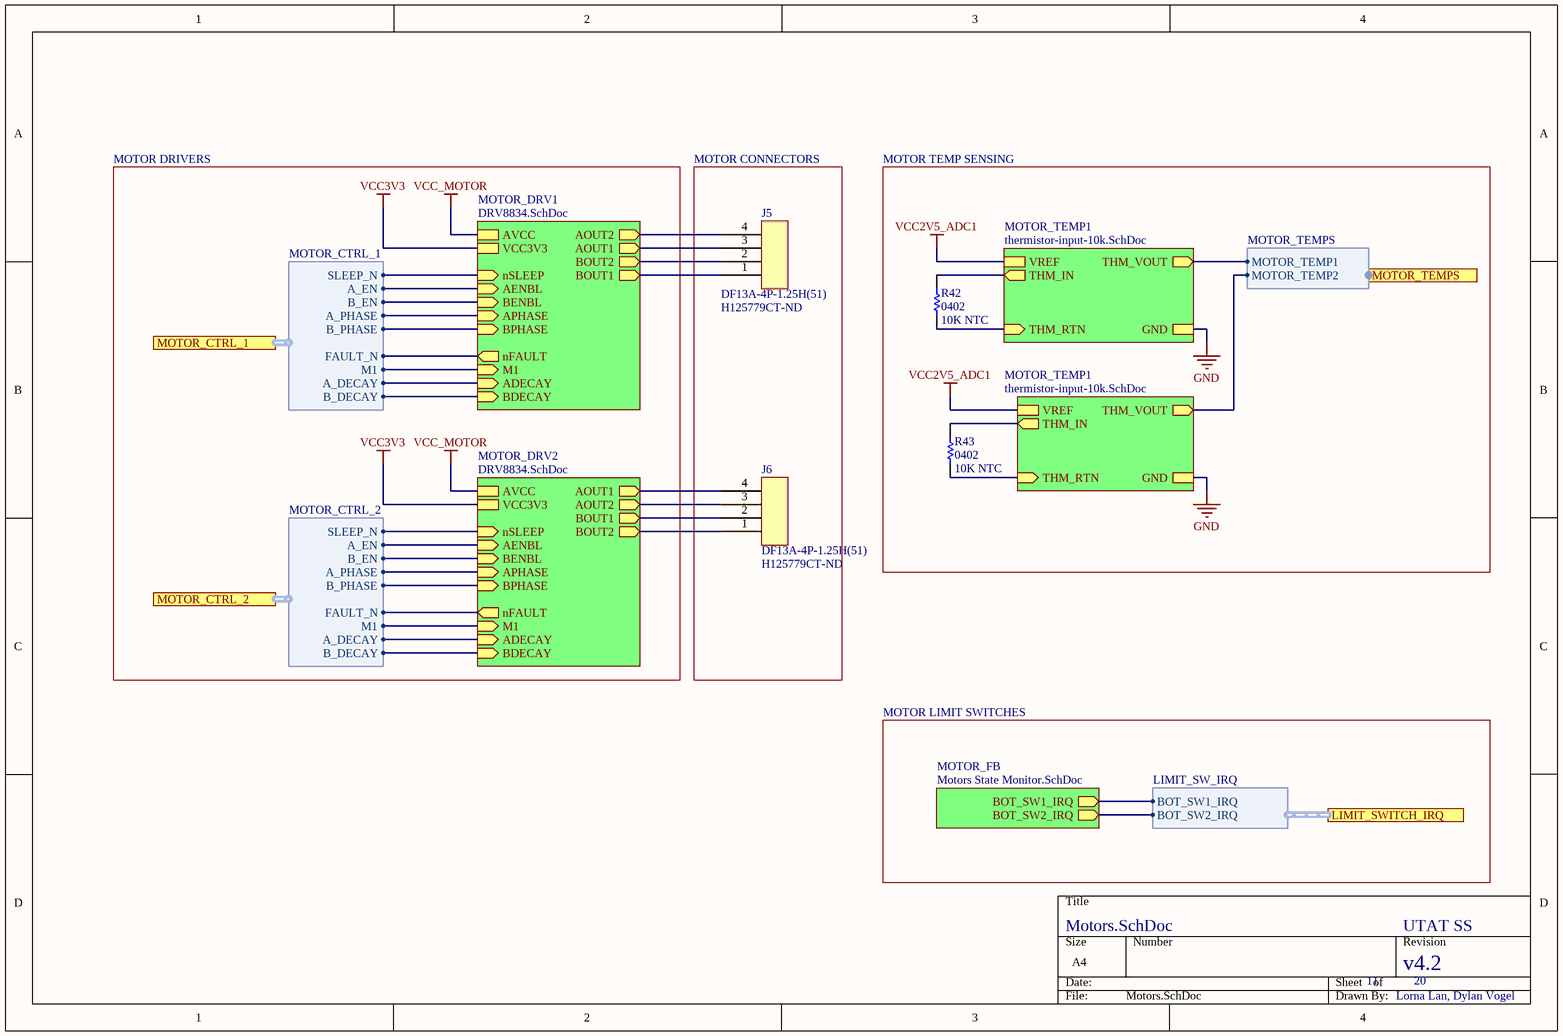
[diagram p4: Motors.SchDoc]

### Parts
J5  DF13A-4P-1.25H(51)  Supplier Part Number 1: H125779CT-ND  [DF13A-4P-1.25H(51)]
J6  DF13A-4P-1.25H(51)  Supplier Part Number 1: H125779CT-ND  [DF13A-4P-1.25H(51)]
R42  0402  value 10K NTC  [RES0402R]
R43  0402  value 10K NTC  [RES0402R]

### Blocks framed on the sheet
MOTOR CONNECTORS: J5 J6
MOTOR TEMP SENSING: R42 R43

### Sub-sheets
MOTOR_DRV1 = DRV8834.SchDoc: nSLEEP (in), nFAULT (out), AVCC, M1 (in), ADECAY (in), BDECAY (in), BPHASE (in), BENBL (in), APHASE (in), AENBL (in), VCC3V3, AOUT1 (out), BOUT2 (out), BOUT1 (out), AOUT2 (out)
MOTOR_DRV2 = DRV8834.SchDoc: nSLEEP (in), nFAULT (out), AVCC, M1 (in), ADECAY (in), BDECAY (in), BPHASE (in), BENBL (in), APHASE (in), AENBL (in), VCC3V3, BOUT2 (out), BOUT1 (out), AOUT2 (out), AOUT1 (out)
MOTOR_FB = Motors State Monitor.SchDoc: BOT_SW2_IRQ (out), BOT_SW1_IRQ (out)
MOTOR_TEMP1 = thermistor-input-10k.SchDoc (file not in this document): GND, VREF, THM_RTN (in), THM_IN (out), THM_VOUT (out)
MOTOR_TEMP1 = thermistor-input-10k.SchDoc (file not in this document): GND, VREF, THM_RTN (in), THM_IN (out), THM_VOUT (out)

### Ports
LIMIT_SWITCH_IRQ (harness LIMIT_SW_IRQ), MOTOR_CTRL_1 (harness MOTOR_CTRL_1), MOTOR_CTRL_2 (harness MOTOR_CTRL_2), MOTOR_TEMPS (harness MOTOR_TEMPS)

### Harnesses
MOTOR_CTRL_1: SLEEP_N, A_EN, B_EN, A_PHASE, B_PHASE, FAULT_N, M1, A_DECAY, B_DECAY
MOTOR_CTRL_2: SLEEP_N, A_EN, B_EN, A_PHASE, B_PHASE, FAULT_N, M1, A_DECAY, B_DECAY
LIMIT_SW_IRQ: BOT_SW1_IRQ, BOT_SW2_IRQ
MOTOR_TEMPS: MOTOR_TEMP1, MOTOR_TEMP2

### Nets
GND: sheet MOTOR_TEMP1/GND, sheet MOTOR_TEMP1/GND
VCC2V5_ADC1: sheet MOTOR_TEMP1/VREF, sheet MOTOR_TEMP1/VREF
VCC3V3: sheet MOTOR_DRV1/VCC3V3, sheet MOTOR_DRV2/VCC3V3
VCC_MOTOR: sheet MOTOR_DRV1/AVCC, sheet MOTOR_DRV2/AVCC
A_PHASE_MOT1: sheet MOTOR_DRV1/APHASE, port MOTOR_CTRL_1.A_PHASE
A_PHASE_MOT2: sheet MOTOR_DRV2/APHASE, port MOTOR_CTRL_2.A_PHASE
ADECAY_MOTOR_DRV1: sheet MOTOR_DRV1/ADECAY, port MOTOR_CTRL_1.A_DECAY
ADECAY_MOTOR_DRV2: sheet MOTOR_DRV2/ADECAY, port MOTOR_CTRL_2.A_DECAY
AENBL_MOTOR_DRV1: sheet MOTOR_DRV1/AENBL, port MOTOR_CTRL_1.A_EN
AENBL_MOTOR_DRV2: sheet MOTOR_DRV2/AENBL, port MOTOR_CTRL_2.A_EN
AOUT1: J6.4 ; sheet MOTOR_DRV2/AOUT1
AOUT1: J5.3 ; sheet MOTOR_DRV1/AOUT1  [a separate net that carries the same name]
AOUT2: J6.3 ; sheet MOTOR_DRV2/AOUT2
AOUT2: J5.4 ; sheet MOTOR_DRV1/AOUT2  [a separate net that carries the same name]
B_PHASE_MOT1: sheet MOTOR_DRV1/BPHASE, port MOTOR_CTRL_1.B_PHASE
B_PHASE_MOT2: sheet MOTOR_DRV2/BPHASE, port MOTOR_CTRL_2.B_PHASE
BDECAY_MOTOR_DRV1: sheet MOTOR_DRV1/BDECAY, port MOTOR_CTRL_1.B_DECAY
BDECAY_MOTOR_DRV2: sheet MOTOR_DRV2/BDECAY, port MOTOR_CTRL_2.B_DECAY
BENBL_MOTOR_DRV1: sheet MOTOR_DRV1/BENBL, port MOTOR_CTRL_1.B_EN
BENBL_MOTOR_DRV2: sheet MOTOR_DRV2/BENBL, port MOTOR_CTRL_2.B_EN
BOT_SW1_IRQ: sheet MOTOR_FB/BOT_SW1_IRQ, port LIMIT_SWITCH_IRQ.BOT_SW1_IRQ
BOT_SW2_IRQ: sheet MOTOR_FB/BOT_SW2_IRQ, port LIMIT_SWITCH_IRQ.BOT_SW2_IRQ
BOUT1: J6.2 ; sheet MOTOR_DRV2/BOUT1
BOUT1: J5.1 ; sheet MOTOR_DRV1/BOUT1  [a separate net that carries the same name]
BOUT2: J6.1 ; sheet MOTOR_DRV2/BOUT2
BOUT2: J5.2 ; sheet MOTOR_DRV1/BOUT2  [a separate net that carries the same name]
M1_MOTOR_DRV1: sheet MOTOR_DRV1/M1, port MOTOR_CTRL_1.M1
M1_MOTOR_DRV2: sheet MOTOR_DRV2/M1, port MOTOR_CTRL_2.M1
nFAULT_MOTOR_DRV1: sheet MOTOR_DRV1/nFAULT, port MOTOR_CTRL_1.FAULT_N
nFAULT_MOTOR_DRV2: sheet MOTOR_DRV2/nFAULT, port MOTOR_CTRL_2.FAULT_N
nSLEEP_MOTOR_DRV1: sheet MOTOR_DRV1/nSLEEP, port MOTOR_CTRL_1.SLEEP_N
nSLEEP_MOTOR_DRV2: sheet MOTOR_DRV2/nSLEEP, port MOTOR_CTRL_2.SLEEP_N
NetR42_1: R42.1 ; sheet MOTOR_TEMP1/THM_RTN
NetR42_2: R42.2 ; sheet MOTOR_TEMP1/THM_IN
NetR43_1: R43.1 ; sheet MOTOR_TEMP1/THM_RTN
NetR43_2: R43.2 ; sheet MOTOR_TEMP1/THM_IN
(unnamed): sheet MOTOR_TEMP1/THM_VOUT, port MOTOR_TEMPS.MOTOR_TEMP1
(unnamed): sheet MOTOR_TEMP1/THM_VOUT, port MOTOR_TEMPS.MOTOR_TEMP2

### Notes on the sheet
- MOTOR DRIVERS
- MOTOR LIMIT SWITCHES

### Library data of the parts
J5 J6 = DF13A-4P-1.25H(51): 4 pos DF13 right angle surface mount connector; Supplier 1: Digi-Key
R42 R43 = RES0402: 0402 resistor

## Sheet Motors State Monitor.SchDoc
size A4; DrawnBy: Lorna Lan, Dylan Vogel; DocumentNumber: 13; Revision: v4.2; SheetNumber: 13; SheetTotal: 20
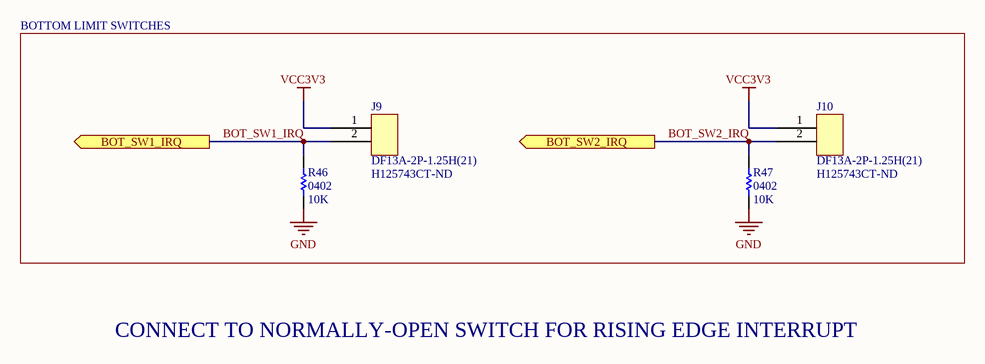
[diagram p5: Motors State Monitor.SchDoc]

### Parts
J9  DF13A-2P-1.25H(21)  Supplier Part Number 1: H125743CT-ND  [DF13A-2P-1.25H(21)]
J10  DF13A-2P-1.25H(21)  Supplier Part Number 1: H125743CT-ND  [DF13A-2P-1.25H(21)]
R46  0402  value 10K  [RES0402R]
R47  0402  value 10K  [RES0402R]

### Blocks framed on the sheet
BOTTOM LIMIT SWITCHES: J9 J10 R46 R47

### Ports
BOT_SW1_IRQ (out), BOT_SW2_IRQ (out)

### Nets
GND: R46.1 R47.1
VCC3V3: J9.1 J10.1
BOT_SW1_IRQ: J9.2 R46.2 ; port BOT_SW1_IRQ
BOT_SW2_IRQ: J10.2 R47.2 ; port BOT_SW2_IRQ

### Notes on the sheet
- CONNECT TO NORMALLY-OPEN SWITCH FOR RISING EDGE INTERRUPT

### Library data of the parts
J9 J10 = DF13A-2P-1.25H(21): 2 pos DF13 right angle surface mount connector; Supplier 1: Digi-Key
R46 R47 = RES0402: as R75 on sheet Environmental Sensors; Supplier 1: Digi-Key; Supplier Part Number 1: P10.0KLCT-ND; Stock 1: 14350001; Pricing 1: 1=0.1, 10=0.045, 100=0.0183, 1000=0.00823, 2500=0.00715, 5000=0.0059 (USD); Mount: Surface Mount; Case/Package: 0402; Number of Pins: 2; Case Code (Metric): 1005; Case Code (Imperial): 0402; Contact Plating: Tin; Min Operating Temperature: -55°C; Max Operating Temperature: 155°C; Packaging: Tape and Reel; Package Quantity: 1; Composition: Thick Film; Number of Terminations: 2; Termination: SMD/SMT; Military Standard: Not; Max Power Dissipation: 100mW; Voltage Rating (DC): 50V; Features: Automotive AEC-Q200; Length: 1mm; Height: 0.35mm; Width: 0.02inch; Depth: 0.5mm; Radiation Hardening: No; REACH SVHC: No SVHC; Lead Free: Lead Free; ComponentLink1URL: http://industrial.panasonic.com/www-data/pdf/AOA0000/AOA0000CE2.pdf?src-supplier=Future+Electronics; ComponentLink1Description: http://industrial.panasonic.com/www-data/pdf/AOA0000/AOA0000CE2.pdf?src-supplier=Future+Electronics; ComponentLink2URL: http://industrial.panasonic.com/www-data/pdf/AOA0000/AOA0000CE2.pdf?src-supplier=Avnet+Europe; ComponentLink2Description: http://industrial.panasonic.com/www-data/pdf/AOA0000/AOA0000CE2.pdf?src-supplier=Avnet+Europe; ComponentLink3URL: https://industrial.panasonic.com/cdbs/www-data/pdf/RDA0000/DMA0000COL11.pdf?src-supplier=Mouser; ComponentLink3Description: https://industrial.panasonic.com/cdbs/www-data/pdf/RDA0000/DMA0000COL11.pdf?src-supplier=Mouser; ComponentLink4URL: http://www.farnell.com/datasheets/1678782.pdf?src-supplier=Element14; ComponentLink4Description: http://www.farnell.com/datasheets/1678782.pdf?src-supplier=Element14; ComponentLink5URL: http://www.farnell.com/datasheets/1911175.pdf?src-supplier=Farnell; ComponentLink5Description: http://www.farnell.com/datasheets/1911175.pdf?src-supplier=Farnell; ComponentLink6URL: http://www.jameco.com/Jameco/Products/ProdDS/1987020.pdf?src-supplier=Jameco; ComponentLink6Description: http://www.jameco.com/Jameco/Products/ProdDS/1987020.pdf?src-supplier=Jameco; ComponentLink7URL: http://industrial.panasonic.com/www-data/pdf/AOA0000/AOA0000CE2.pdf?src-supplier=Avnet; ComponentLink7Description: http://industrial.panasonic.com/www-data/pdf/AOA0000/AOA0000CE2.pdf?src-supplier=Avnet; ComponentLink8URL: http://www.alliedelec.com/m/d/623f45ff1957d936ff56d46fd1c28cac.pdf?src-supplier=Allied+Electronics; ComponentLink8Description: http://www.alliedelec.com/m/d/623f45ff1957d936ff56d46fd1c28cac.pdf?src-supplier=Allied+Electronics

## Sheet DRV8834.SchDoc
size A4; DrawnBy: Lorna Lan, Dylan Vogel; DocumentNumber: 12; Revision: v4.2; SheetNumber: 12; SheetTotal: 20
Used 2 times, as channels MOTORS/MOTOR_DRV1, MOTORS/MOTOR_DRV2. Parts and nets are listed once, with the designators drawn on the sheet.
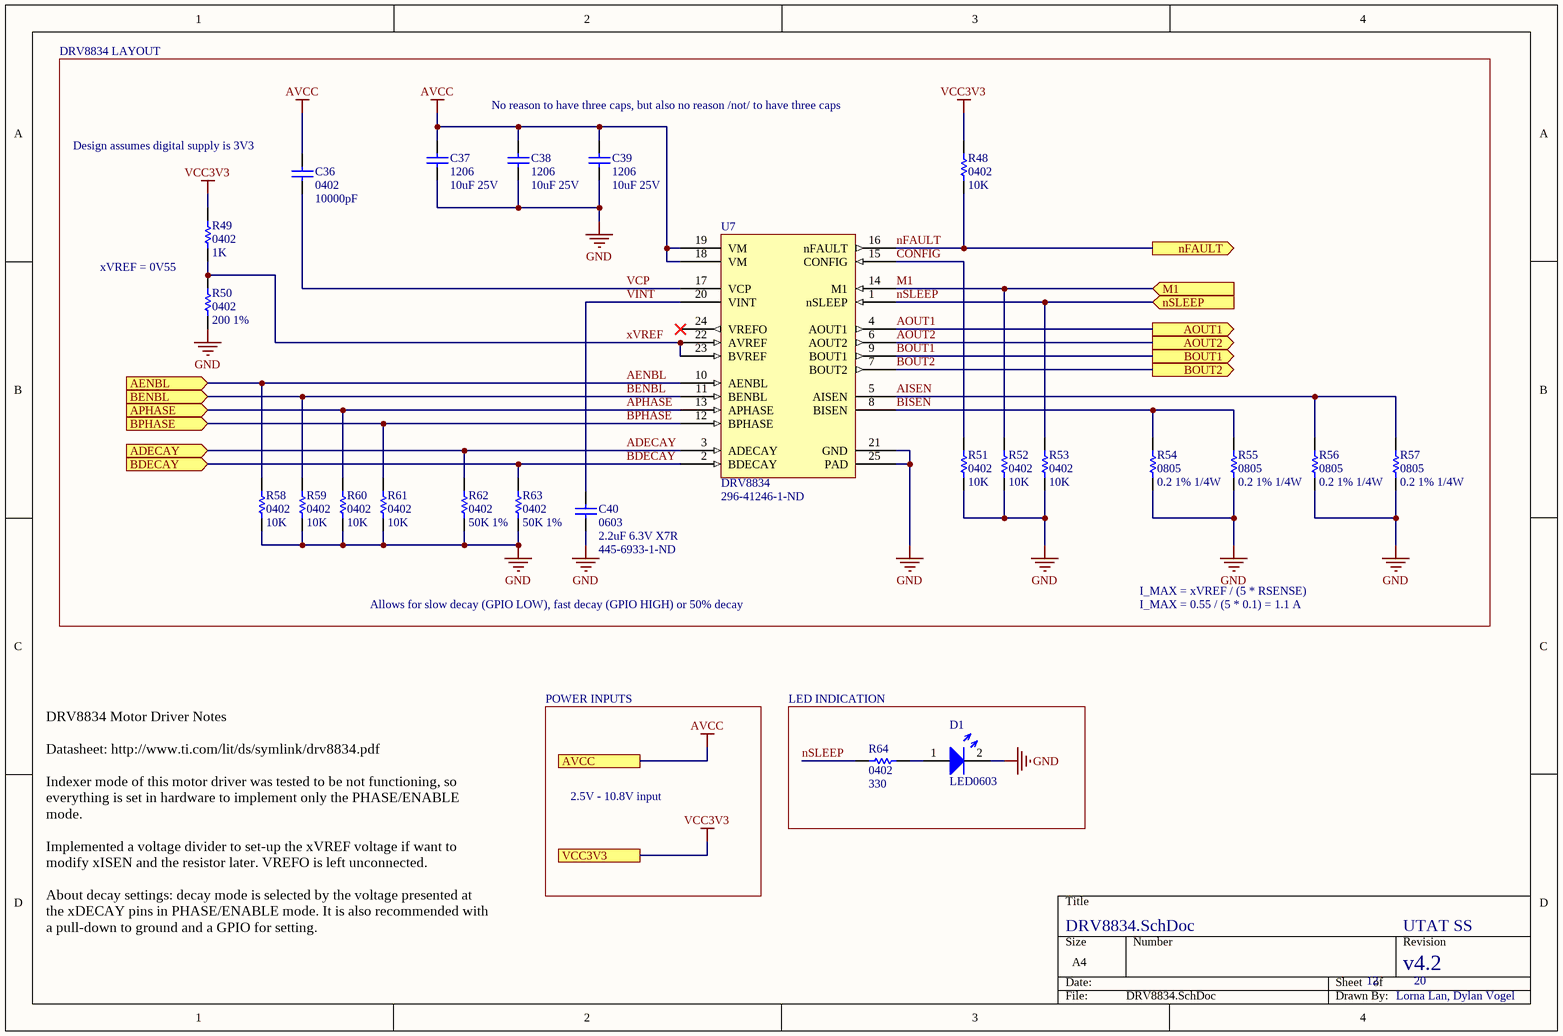
[diagram p6: DRV8834.SchDoc]

### Parts
C36  0402  value 10000pF  [CAP0402R]
C37  1206  value 10uF 25V  [CAP1206R]
C38  1206  value 10uF 25V  [CAP1206R]
C39  1206  value 10uF 25V  [CAP1206R]
C40  0603  value 2.2uF 6.3V X7R  Supplier Part Number 1: 445-6933-1-ND  [CAP0603R]
D1  LED0603  [LED0603]
R48  0402  value 10K  [RES0402R]
R49  0402  value 1K  [RES0402R]
R50  0402  value 200 1%  [RES0402R]
R51  0402  value 10K  [RES0402R]
R52  0402  value 10K  [RES0402R]
R53  0402  value 10K  [RES0402R]
R54  0805  value 0.2 1% 1/4W  [RES0805R]
R55  0805  value 0.2 1% 1/4W  [RES0805R]
R56  0805  value 0.2 1% 1/4W  [RES0805R]
R57  0805  value 0.2 1% 1/4W  [RES0805R]
R58  0402  value 10K  [RES0402R]
R59  0402  value 10K  [RES0402R]
R60  0402  value 10K  [RES0402R]
R61  0402  value 10K  [RES0402R]
R62  0402  value 50K 1%  [RES0402R]
R63  0402  value 50K 1%  [RES0402R]
R64  0402  value 330  [RES0402R]
U7  DRV8834  Supplier Part Number 1: 296-41246-1-ND  [SOP65P640X120-25N]

### Blocks framed on the sheet
LED INDICATION: D1 R64

### Ports
ADECAY (in), AENBL (in), AOUT1 (out), AOUT2 (out), APHASE (in), AVCC, BDECAY (in), BENBL (in), BOUT1 (out), BOUT2 (out), BPHASE (in), M1 (in), nFAULT (out), nSLEEP (in), VCC3V3

### Nets
AVCC: C36.2 C37.2 C38.2 C39.2 U7.18(VM) U7.19(VM) ; port AVCC
GND: C37.1 C38.1 C39.1 C40.2 D1.2 R50.1 R51.2 R52.1 R53.1 R54.1 R55.1 R56.1 R57.1 R58.1 R59.1 R60.1 R61.1 R62.1 R63.1 U7.21(GND) U7.25(PAD)
VCC3V3: R48.2 R49.2 ; port VCC3V3
ADECAY: R62.2 U7.3(ADECAY) ; port ADECAY
AENBL: R58.2 U7.10(AENBL) ; port AENBL
AISEN: R56.2 R57.2 U7.5(AISEN)
AOUT1: U7.4(AOUT1) ; port AOUT1
AOUT2: U7.6(AOUT2) ; port AOUT2
APHASE: R60.2 U7.13(APHASE) ; port APHASE
BDECAY: R63.2 U7.2(BDECAY) ; port BDECAY
BENBL: R59.2 U7.11(BENBL) ; port BENBL
BISEN: R54.2 R55.2 U7.8(BISEN)
BOUT1: U7.9(BOUT1) ; port BOUT1
BOUT2: U7.7(BOUT2) ; port BOUT2
BPHASE: R61.2 U7.12(BPHASE) ; port BPHASE
CONFIG: R51.1 U7.15(CONFIG)
M1: R52.2 U7.14(M1) ; port M1
nFAULT: R48.1 U7.16(nFAULT) ; port nFAULT
nSLEEP: R53.2 R64.2 U7.1(nSLEEP) ; port nSLEEP
VCP: C36.1 U7.17(VCP)
VINT: C40.1 U7.20(VINT)
xVREF: R49.1 R50.2 U7.22(AVREF) U7.23(BVREF)
NetD1_1: D1.1 R64.1

Not connected (* = marked no-connect by the designer): U7 24(VREFO)*

### Channels
MOTORS/MOTOR_DRV1: designators end in _MOTOR_DRV1; ports ADECAY=ADECAY_MOTOR_DRV1 AENBL=AENBL_MOTOR_DRV1 AOUT1=AOUT1 AOUT2=AOUT2 APHASE=A_PHASE_MOT1 AVCC=VCC_MOTOR BDECAY=BDECAY_MOTOR_DRV1 BENBL=BENBL_MOTOR_DRV1 BOUT1=BOUT1 BOUT2=BOUT2 BPHASE=B_PHASE_MOT1 M1=M1_MOTOR_DRV1 nFAULT=nFAULT_MOTOR_DRV1 nSLEEP=nSLEEP_MOTOR_DRV1 VCC3V3=VCC3V3
MOTORS/MOTOR_DRV2: designators end in _MOTOR_DRV2; ports ADECAY=ADECAY_MOTOR_DRV2 AENBL=AENBL_MOTOR_DRV2 AOUT1=AOUT1 AOUT2=AOUT2 APHASE=A_PHASE_MOT2 AVCC=VCC_MOTOR BDECAY=BDECAY_MOTOR_DRV2 BENBL=BENBL_MOTOR_DRV2 BOUT1=BOUT1 BOUT2=BOUT2 BPHASE=B_PHASE_MOT2 M1=M1_MOTOR_DRV2 nFAULT=nFAULT_MOTOR_DRV2 nSLEEP=nSLEEP_MOTOR_DRV2 VCC3V3=VCC3V3

### Notes on the sheet
- DRV8834 LAYOUT
- No reason to have three caps, but also no reason /not/ to have three caps
- (near C36) Design assumes digital supply is 3V3
- xVREF = 0V55
- Allows for slow decay (GPIO LOW), fast decay (GPIO HIGH) or 50% decay
- I_MAX = xVREF / (5 * RSENSE)
- I_MAX = 0.55 / (5 * 0.1) = 1.1 A
- POWER INPUTS
- 2.5V - 10.8V input
- DRV8834 Motor Driver Notes
  Datasheet: http://www.ti.com/lit/ds/symlink/drv8834.pdf
  Indexer mode of this motor driver was tested to be not functioning, so everything is set in hardware to implement only the PHASE/ENABLE mode.
  Implemented a voltage divider to set-up the xVREF voltage if want to modify xISEN and the resistor later. VREFO is left unconnected.
  About decay settings: decay mode is selected by the voltage presented at the xDECAY pins in PHASE/ENABLE mode. It is also recommended with a pull-down to ground and a GPIO for setting.

### Library data of the parts
C36 = Cap: Capacitor; Published: 8-Jun-2000; LatestRevisionDate: 17-Jul-2002; LatestRevisionNote: Re-released for DXP Platform.; PackageReference: RAD-0.3; Publisher: Altium Limited; PackageDescription: Radial Cap, Thru-Hole; 2 Leads; 0.3 in Pin Spacing
C37-C39 = CAP1206: 1206 capacitor; Supplier 1: Digi-Key; Supplier Part Number 1: 445-174428-1-ND
C40 = CAP0603: 0603 capacitor; Supplier 1: Digi-Key
D1 = LED0603: Generic 0603 LED. Use ChipLED from Osram for generic ones.
R48-R53 R58-R63 = RES0402: 0402 resistor
  R49: Supplier 1: Digi-Key; Supplier Part Number 1: YAG1234CT-ND
R54-R57 = RES0805: 0805 resistor; Supplier 1: Digi-Key; Supplier Part Number 1: WSLA-.20CT-ND
R64 = RES0402: 0402 resistor; Manufacturer: TE Connectivity; Manufacturer Part Number: CRGCQ0402F330R; Resistance: 330R; Tolerance: 1%; Max Power Dissipation: 63mW; Temperature Coefficient: 100ppm/°C; Supplier 1: Digi-Key; Supplier Part Number 1: A129621CT-ND; Stock 1: 224275; Pricing 1: 1=0.1, 10=0.022, 100=0.009, 1000=0.00406, 2500=0.00352, 5000=0.00291 (USD); Case/Package: 0402; Case Code (Imperial): 0402; Case Code (Metric): 1005; Min Operating Temperature: -55°C; Max Operating Temperature: 155°C; Composition: Thick Film; Features: Moisture Resistant,Automotive AEC-Q200; Packaging: Tape and Reel; Number of Terminations: 2
U7 = DRV8834: Dual-bridge stepper or dc motor driver. 1.5A per coil with 2.5-10.8 V load supply.; Supplier 1: Digi-Key; ComponentLink1Description: Datasheet; ComponentLink1URL: http://www.ti.com/lit/ds/symlink/drv8834.pdf

## Sheet Heater Control.SchDoc
size A4; DrawnBy: Lorna Lan; DocumentNumber: 15; Revision: v4.3; SheetNumber: 15; SheetTotal: 20
Used 5 times, as channels HEATER1, HEATER2, HEATER3, HEATER4, HEATER5. Parts and nets are listed once, with the designators drawn on the sheet.
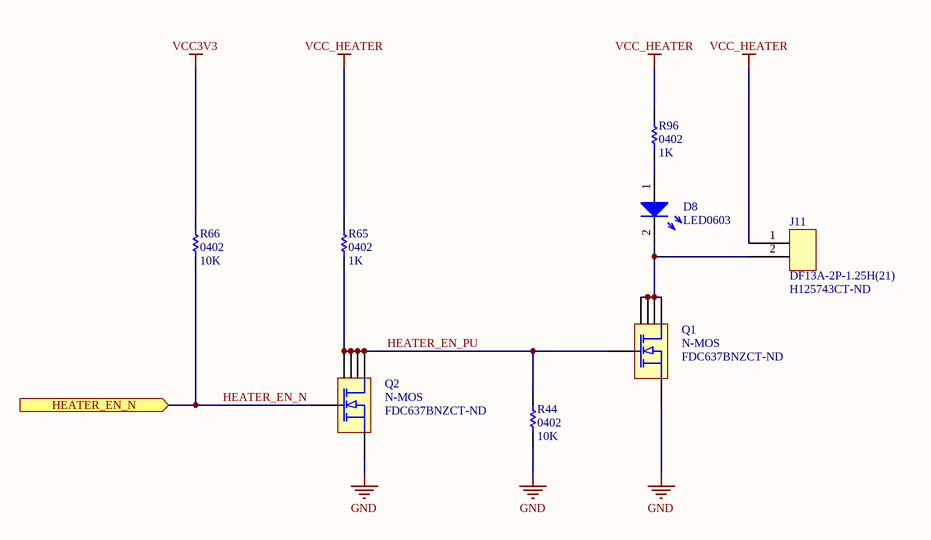
[diagram p7: Heater Control.SchDoc]

### Parts
D8  LED0603  [LED0603]
J11  DF13A-2P-1.25H(21)  Supplier Part Number 1: H125743CT-ND  [DF13A-2P-1.25H(21)]
Q1  N-MOS  [SOT95P280X145-6N]
Q2  N-MOS  [SOT95P280X145-6N]
R44  0402  value 10K  [RES0402R]
R65  0402  value 1K  [RES0402R]
R66  0402  value 10K  [RES0402R]
R96  0402  value 1K  [RES0402R]

### Ports
HEATER_EN_N (in)

### Nets
GND: Q1.4(S) Q2.4(S) R44.1
VCC3V3: R66.2
VCC_HEATER: J11.1 R65.2 R96.2
HEATER_EN_N: Q2.3(G) R66.1 ; port HEATER_EN_N
HEATER_EN_PU: Q1.3(G) Q2.1(D) Q2.2(D) Q2.5(D) Q2.6(D) R44.2 R65.1
NetD8_1: D8.1 R96.1
NetD8_2: D8.2 J11.2 Q1.1(D) Q1.2(D) Q1.5(D) Q1.6(D)

### Channels
HEATER1: designators end in _HEATER1; ports HEATER_EN_N=HEATER_EN_N_HEATER1
HEATER2: designators end in _HEATER2; ports HEATER_EN_N=HEATER_EN_N_HEATER2
HEATER3: designators end in _HEATER3; ports HEATER_EN_N=HEATER_EN_N_HEATER3
HEATER4: designators end in _HEATER4; ports HEATER_EN_N=HEATER_EN_N_HEATER4
HEATER5: designators end in _HEATER5; ports HEATER_EN_N=HEATER_EN_N_HEATER5

### Library data of the parts
D8 = LED0603: as D1 on sheet DRV8834
J11 = DF13A-2P-1.25H(21): as J9 on sheet Motors State Monitor; Supplier 1: Digi-Key
Q1 Q2 = FDC637BNZCT-ND: 20V 6.2A, N-MOS, low gate on voltage; Supplier 1: Digi-Key; Supplier Part Number 1: FDC637BNZCT-ND
R44 R66 = RES0402: as R75 on sheet Environmental Sensors; Supplier 1: Digi-Key; Supplier Part Number 1: P10.0KLCT-ND; Stock 1: 14350001; Pricing 1: 1=0.1, 10=0.045, 100=0.0183, 1000=0.00823, 2500=0.00715, 5000=0.0059 (USD); Mount: Surface Mount; Case/Package: 0402; Number of Pins: 2; Case Code (Metric): 1005; Case Code (Imperial): 0402; Contact Plating: Tin; Min Operating Temperature: -55°C; Max Operating Temperature: 155°C; Packaging: Tape and Reel; Package Quantity: 1; Composition: Thick Film; Number of Terminations: 2; Termination: SMD/SMT; Military Standard: Not; Max Power Dissipation: 100mW; Voltage Rating (DC): 50V; Features: Automotive AEC-Q200; Length: 1mm; Height: 0.35mm; Width: 0.02inch; Depth: 0.5mm; Radiation Hardening: No; REACH SVHC: No SVHC; Lead Free: Lead Free; ComponentLink1URL: http://industrial.panasonic.com/www-data/pdf/AOA0000/AOA0000CE2.pdf?src-supplier=Future+Electronics; ComponentLink1Description: http://industrial.panasonic.com/www-data/pdf/AOA0000/AOA0000CE2.pdf?src-supplier=Future+Electronics; ComponentLink2URL: http://industrial.panasonic.com/www-data/pdf/AOA0000/AOA0000CE2.pdf?src-supplier=Avnet+Europe; ComponentLink2Description: http://industrial.panasonic.com/www-data/pdf/AOA0000/AOA0000CE2.pdf?src-supplier=Avnet+Europe; ComponentLink3URL: https://industrial.panasonic.com/cdbs/www-data/pdf/RDA0000/DMA0000COL11.pdf?src-supplier=Mouser; ComponentLink3Description: https://industrial.panasonic.com/cdbs/www-data/pdf/RDA0000/DMA0000COL11.pdf?src-supplier=Mouser; ComponentLink4URL: http://www.farnell.com/datasheets/1678782.pdf?src-supplier=Element14; ComponentLink4Description: http://www.farnell.com/datasheets/1678782.pdf?src-supplier=Element14; ComponentLink5URL: http://www.farnell.com/datasheets/1911175.pdf?src-supplier=Farnell; ComponentLink5Description: http://www.farnell.com/datasheets/1911175.pdf?src-supplier=Farnell; ComponentLink6URL: http://www.jameco.com/Jameco/Products/ProdDS/1987020.pdf?src-supplier=Jameco; ComponentLink6Description: http://www.jameco.com/Jameco/Products/ProdDS/1987020.pdf?src-supplier=Jameco; ComponentLink7URL: http://industrial.panasonic.com/www-data/pdf/AOA0000/AOA0000CE2.pdf?src-supplier=Avnet; ComponentLink7Description: http://industrial.panasonic.com/www-data/pdf/AOA0000/AOA0000CE2.pdf?src-supplier=Avnet; ComponentLink8URL: http://www.alliedelec.com/m/d/623f45ff1957d936ff56d46fd1c28cac.pdf?src-supplier=Allied+Electronics; ComponentLink8Description: http://www.alliedelec.com/m/d/623f45ff1957d936ff56d46fd1c28cac.pdf?src-supplier=Allied+Electronics
R65 R96 = RES0402: 0402 resistor